# EAGLE design Display_Board (EAGLE 8.4.1)

## Sheet 1 of 3: Micro and CAN
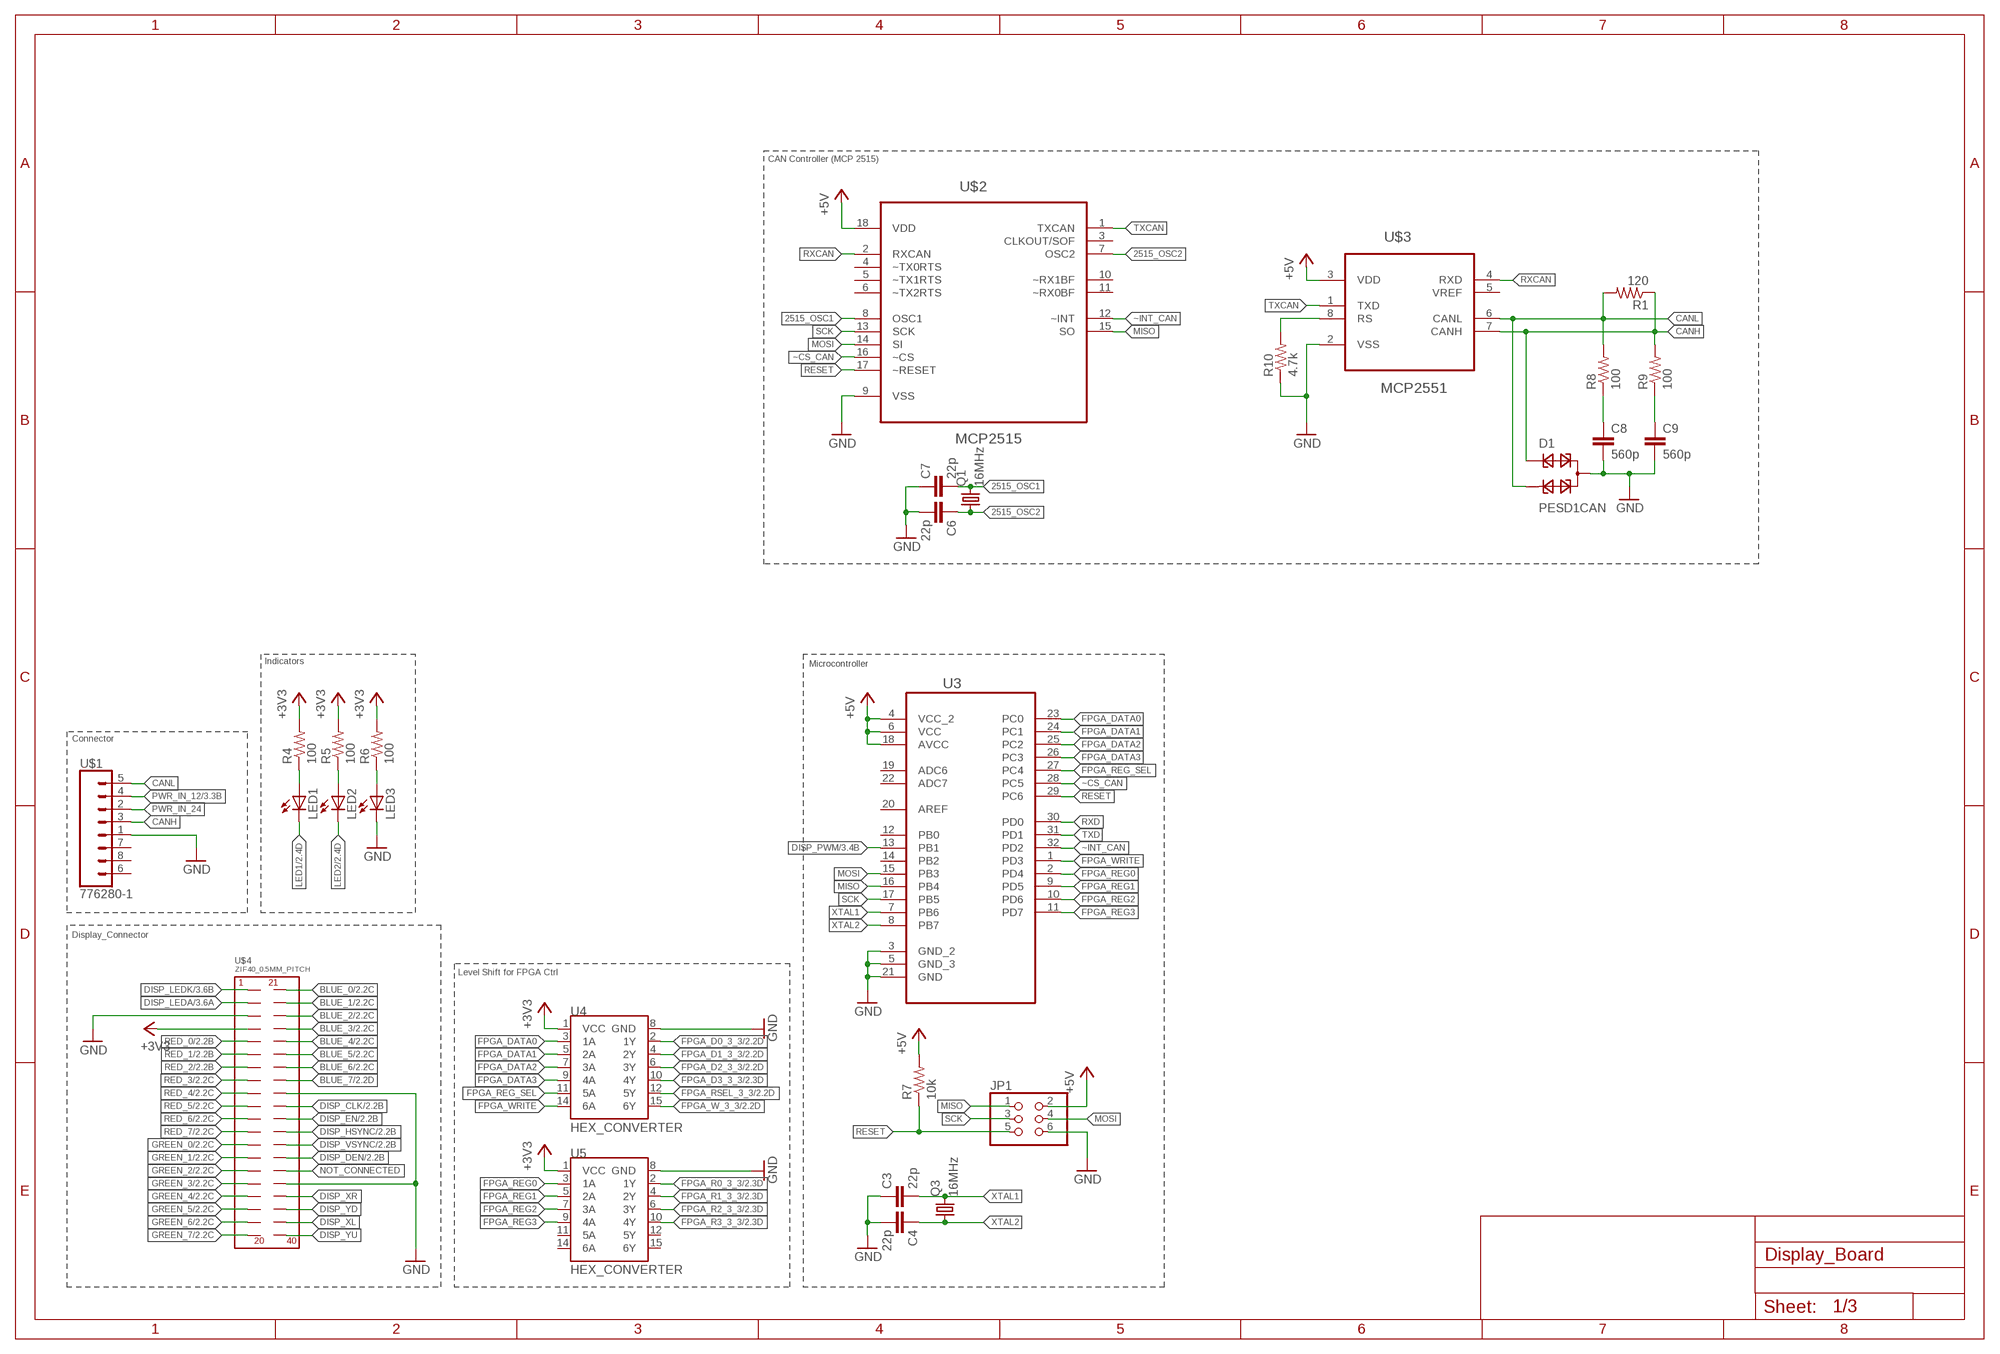
[diagram p0: schematic, sheet 1]

### Parts
C3  22p  C-EUC0805K  [C0805K]
C4  22p  C-EUC0805K  [C0805K]
C6  22p  C-EUC0805K  [C0805K]
C7  22p  C-EUC0805K  [C0805K]
C8  560p  C-EUC0805K  [C0805K]
C9  560p  C-EUC0805K  [C0805K]
D1  PESD1CAN  [SOT23]
JP1  PINHD-2X3  [2X03]
LED1  LEDCHIP-LED0805  [CHIP-LED0805]
LED2  LEDCHIP-LED0805  [CHIP-LED0805]
LED3  LEDCHIP-LED0805  [CHIP-LED0805]
Q1  16MHz  CRYSTALCTS406  [CTS406]
Q3  16MHz  CRYSTALCTS406  [CTS406]
R1  120  R-US_R0805  [R0805]
R4  100  R-US_R0805  [R0805]
R5  100  R-US_R0805  [R0805]
R6  100  R-US_R0805  [R0805]
R7  10k  R-US_R0805  [R0805]
R8  100  R-US_R0805  [R0805]
R9  100  R-US_R0805  [R0805]
R10  4.7k  R-US_R0805  [R0805]
U3  ATMEGA328P-AU  [QFP80P900X900X120-32N]
U4  HEX_CONVERTER  [SO016]
U5  HEX_CONVERTER  [SO016]
U$1  776280-1  [776280-1]
U$2  MCP2515  MCP2515-I/SO  [SOIC127P1034X264-18N]
U$3  MCP2551  MCP2551-I/SN  [SOIC127P600X175-8N]
U$4  ZIF40_0.5MM_PITCH  [ZIF40]

### Nets
2515_OSC1: C7.2 Q1.3 U$2.8(OSC1)
2515_OSC2: C6.1 Q1.1 U$2.7(OSC2)
+3V3: R4.2 R5.2 R6.2 U4.1(VCC) U5.1(VCC) U$4.P$4 ; also sheet 2,3
+5V: JP1.2 R7.2 U3.4(VCC_2) U3.6(VCC) U3.18(AVCC) U$2.18(VDD) U$3.3(VDD) ; also sheet 3
BLUE_0: U$4.P$21 ; also sheet 2
BLUE_1: U$4.P$22 ; also sheet 2
BLUE_2: U$4.P$23 ; also sheet 2
BLUE_3: U$4.P$24 ; also sheet 2
BLUE_4: U$4.P$25 ; also sheet 2
BLUE_5: U$4.P$26 ; also sheet 2
BLUE_6: U$4.P$27 ; also sheet 2
BLUE_7: U$4.P$28 ; also sheet 2
CANH: D1.1 R1.1 R9.2 U$1.3 U$3.7(CANH)
CANL: D1.2 R1.2 R8.2 U$1.5 U$3.6(CANL)
DISP_CLK: U$4.P$30 ; also sheet 2
DISP_DEN: U$4.P$34 ; also sheet 2
DISP_EN: U$4.P$31 ; also sheet 2
DISP_HSYNC: U$4.P$32 ; also sheet 2
DISP_LEDA: U$4.P$2 ; also sheet 3
DISP_LEDK: U$4.P$1 ; also sheet 3
DISP_PWM: U3.13(PB1) ; also sheet 3
DISP_VSYNC: U$4.P$33 ; also sheet 2
DISP_XL: U$4.P$39
DISP_XR: U$4.P$37
DISP_YD: U$4.P$38
DISP_YU: U$4.P$40
FPGA_D0_3_3: U4.2(1Y) ; also sheet 2
FPGA_D1_3_3: U4.4(2Y) ; also sheet 2
FPGA_D2_3_3: U4.6(3Y) ; also sheet 2
FPGA_D3_3_3: U4.10(4Y) ; also sheet 2
FPGA_DATA0: U3.23(PC0) U4.3(1A)
FPGA_DATA1: U3.24(PC1) U4.5(2A)
FPGA_DATA2: U3.25(PC2) U4.7(3A)
FPGA_DATA3: U3.26(PC3) U4.9(4A)
FPGA_R0_3_3: U5.2(1Y) ; also sheet 2
FPGA_R1_3_3: U5.4(2Y) ; also sheet 2
FPGA_R2_3_3: U5.6(3Y) ; also sheet 2
FPGA_R3_3_3: U5.10(4Y) ; also sheet 2
FPGA_REG0: U3.2(PD4) U5.3(1A)
FPGA_REG1: U3.9(PD5) U5.5(2A)
FPGA_REG2: U3.10(PD6) U5.7(3A)
FPGA_REG3: U3.11(PD7) U5.9(4A)
FPGA_REG_SEL: U3.27(PC4) U4.11(5A)
FPGA_RSEL_3_3: U4.12(5Y) ; also sheet 2
FPGA_W_3_3: U4.15(6Y) ; also sheet 2
FPGA_WRITE: U3.1(PD3) U4.14(6A)
GND: C3.1 C4.2 C6.2 C7.1 C8.2 C9.2 D1.3 JP1.6 LED3.C R10.1 U3.3(GND_2) U3.5(GND_3) U3.21(GND) U4.8(GND) U5.8(GND) U$1.1 U$2.9(VSS) U$3.2(VSS) U$4.P$3 U$4.P$29 U$4.P$36 ; also sheet 2,3
GREEN_0: U$4.P$13 ; also sheet 2
GREEN_1: U$4.P$14 ; also sheet 2
GREEN_2: U$4.P$15 ; also sheet 2
GREEN_3: U$4.P$16 ; also sheet 2
GREEN_4: U$4.P$17 ; also sheet 2
GREEN_5: U$4.P$18 ; also sheet 2
GREEN_6: U$4.P$19 ; also sheet 2
GREEN_7: U$4.P$20 ; also sheet 2
LED1: LED1.C ; also sheet 2
LED2: LED2.C ; also sheet 2
MISO: JP1.1 U3.16(PB4) U$2.15(SO)
MOSI: JP1.4 U3.15(PB3) U$2.14(SI)
N$2: LED1.A R4.1
N$3: LED2.A R5.1
N$4: LED3.A R6.1
N$5: R10.2 U$3.8(RS)
N$6: C8.1 R8.1
N$7: C9.1 R9.1
NOT_CONNECTED: U$4.P$35
PWR_IN_12: U$1.4 ; also sheet 3
PWR_IN_24: U$1.2
RED_0: U$4.P$5 ; also sheet 2
RED_1: U$4.P$6 ; also sheet 2
RED_2: U$4.P$7 ; also sheet 2
RED_3: U$4.P$8 ; also sheet 2
RED_4: U$4.P$9 ; also sheet 2
RED_5: U$4.P$10 ; also sheet 2
RED_6: U$4.P$11 ; also sheet 2
RED_7: U$4.P$12 ; also sheet 2
RESET: JP1.5 R7.1 U3.29(PC6) U$2.17(~RESET)
RXCAN: U$2.2(RXCAN) U$3.4(RXD)
RXD: U3.30(PD0)
SCK: JP1.3 U3.17(PB5) U$2.13(SCK)
TXCAN: U$2.1(TXCAN) U$3.1(TXD)
TXD: U3.31(PD1)
XTAL1: C3.2 Q3.3 U3.7(PB6)
XTAL2: C4.1 Q3.1 U3.8(PB7)
~CS_CAN: U3.28(PC5) U$2.16(~CS)
~INT_CAN: U3.32(PD2) U$2.12(~INT)
Unconnected: U3.12(PB0) U3.14(PB2) U3.19(ADC6) U3.20(AREF) U3.22(ADC7) U5.11(5A) U5.12(5Y) U5.14(6A) U5.15(6Y) U$1.6 U$1.7 U$1.8 U$2.3(CLKOUT/SOF) U$2.4(~TX0RTS) U$2.5(~TX1RTS) U$2.6(~TX2RTS) U$2.10(~RX1BF) U$2.11(~RX0BF) U$3.5(VREF)

### Notes on the sheet
- CAN Controller (MCP 2515)
- Indicators | Microcontroller
- Connector
- Display_Connector
- Level Shift for FPGA Ctrl

## Sheet 2 of 3: FPGA
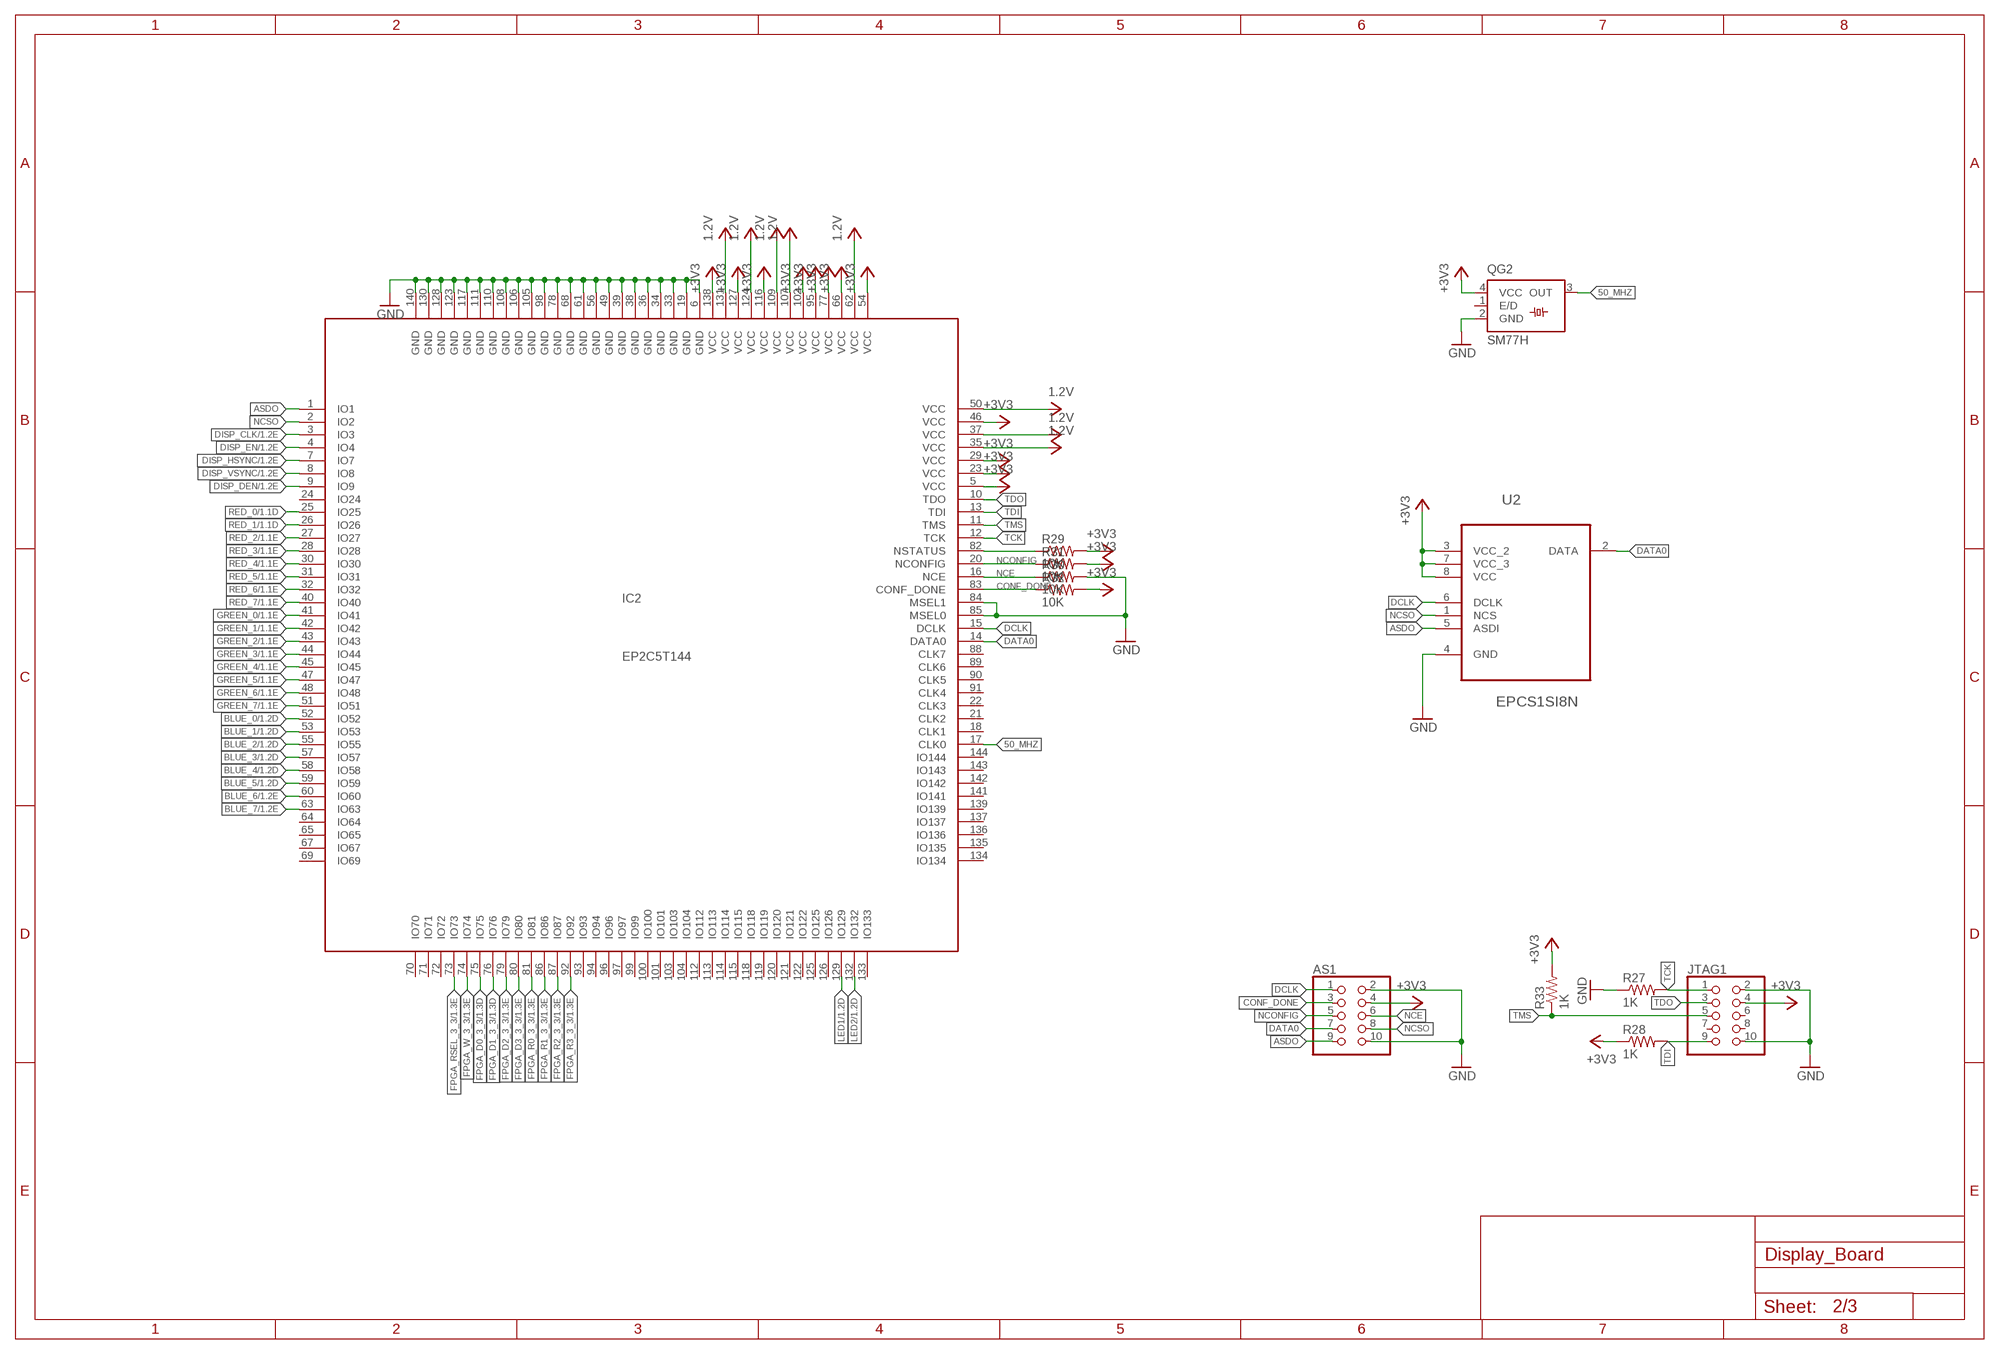
[diagram p1: schematic, sheet 2]

### Parts
AS1  PINHD-2X5  [2X05]
IC2  EP2C5T144  [TQFP144]
JTAG1  PINHD-2X5  [2X05]
QG2  SM77H  [SM77H]
R27  1K  R-US_R0805  [R0805]
R28  1K  R-US_R0805  [R0805]
R29  10K  R-US_R0805  [R0805]
R30  10K  R-US_R0805  [R0805]
R31  10K  R-US_R0805  [R0805]
R32  10K  R-US_R0805  [R0805]
R33  1K  R-US_R0805  [R0805]
U2  EPCS1SI8N  [SOIC127P600X175-8N]

### Nets
50_MHZ: IC2.17(CLK0) QG2.3(OUT)
+3V3: AS1.4 IC2.5(VCC) IC2.23(VCC) IC2.29(VCC) IC2.46(VCC) IC2.54(VCC) IC2.66(VCC) IC2.77(VCC) IC2.95(VCC) IC2.102(VCC) IC2.116(VCC) IC2.127(VCC) IC2.138(VCC) JTAG1.4 QG2.4(VCC) R28.1 R29.2 R31.2 R32.2 R33.2 U2.3(VCC_2) U2.7(VCC_3) U2.8(VCC) ; also sheet 1,3
ASDO: AS1.9 IC2.1(IO1) U2.5(ASDI)
BLUE_0: IC2.52(IO52) ; also sheet 1
BLUE_1: IC2.53(IO53) ; also sheet 1
BLUE_2: IC2.55(IO55) ; also sheet 1
BLUE_3: IC2.57(IO57) ; also sheet 1
BLUE_4: IC2.58(IO58) ; also sheet 1
BLUE_5: IC2.59(IO59) ; also sheet 1
BLUE_6: IC2.60(IO60) ; also sheet 1
BLUE_7: IC2.63(IO63) ; also sheet 1
CONF_DONE: AS1.3 IC2.83(CONF_DONE) R32.1
DATA0: AS1.7 IC2.14(DATA0) U2.2(DATA)
DCLK: AS1.1 IC2.15(DCLK) U2.6(DCLK)
DISP_CLK: IC2.3(IO3) ; also sheet 1
DISP_DEN: IC2.9(IO9) ; also sheet 1
DISP_EN: IC2.4(IO4) ; also sheet 1
DISP_HSYNC: IC2.7(IO7) ; also sheet 1
DISP_VSYNC: IC2.8(IO8) ; also sheet 1
FPGA_D0_3_3: IC2.75(IO75) ; also sheet 1
FPGA_D1_3_3: IC2.76(IO76) ; also sheet 1
FPGA_D2_3_3: IC2.79(IO79) ; also sheet 1
FPGA_D3_3_3: IC2.80(IO80) ; also sheet 1
FPGA_R0_3_3: IC2.81(IO81) ; also sheet 1
FPGA_R1_3_3: IC2.86(IO86) ; also sheet 1
FPGA_R2_3_3: IC2.87(IO87) ; also sheet 1
FPGA_R3_3_3: IC2.92(IO92) ; also sheet 1
FPGA_RSEL_3_3: IC2.73(IO73) ; also sheet 1
FPGA_W_3_3: IC2.74(IO74) ; also sheet 1
GND: AS1.2 AS1.10 IC2.6(GND) IC2.19(GND) IC2.33(GND) IC2.34(GND) IC2.36(GND) IC2.38(GND) IC2.39(GND) IC2.49(GND) IC2.56(GND) IC2.61(GND) IC2.68(GND) IC2.78(GND) IC2.84(MSEL1) IC2.85(MSEL0) IC2.98(GND) IC2.105(GND) IC2.106(GND) IC2.108(GND) IC2.110(GND) IC2.111(GND) IC2.117(GND) IC2.123(GND) IC2.128(GND) IC2.130(GND) IC2.140(GND) JTAG1.2 JTAG1.10 QG2.2(GND) R27.1 R30.2 U2.4(GND) ; also sheet 1,3
GREEN_0: IC2.41(IO41) ; also sheet 1
GREEN_1: IC2.42(IO42) ; also sheet 1
GREEN_2: IC2.43(IO43) ; also sheet 1
GREEN_3: IC2.44(IO44) ; also sheet 1
GREEN_4: IC2.45(IO45) ; also sheet 1
GREEN_5: IC2.47(IO47) ; also sheet 1
GREEN_6: IC2.48(IO48) ; also sheet 1
GREEN_7: IC2.51(IO51) ; also sheet 1
LED1: IC2.129(IO129) ; also sheet 1
LED2: IC2.132(IO132) ; also sheet 1
N$21: IC2.82(NSTATUS) R29.1
NCE: AS1.6 IC2.16(NCE) R30.1
NCONFIG: AS1.5 IC2.20(NCONFIG) R31.1
NCSO: AS1.8 IC2.2(IO2) U2.1(NCS)
RED_0: IC2.25(IO25) ; also sheet 1
RED_1: IC2.26(IO26) ; also sheet 1
RED_2: IC2.27(IO27) ; also sheet 1
RED_3: IC2.28(IO28) ; also sheet 1
RED_4: IC2.30(IO30) ; also sheet 1
RED_5: IC2.31(IO31) ; also sheet 1
RED_6: IC2.32(IO32) ; also sheet 1
RED_7: IC2.40(IO40) ; also sheet 1
TCK: IC2.12(TCK) JTAG1.1 R27.2
TDI: IC2.13(TDI) JTAG1.9 R28.2
TDO: IC2.10(TDO) JTAG1.3
TMS: IC2.11(TMS) JTAG1.5 R33.1
VCC: IC2.35(VCC) IC2.37(VCC) IC2.50(VCC) IC2.62(VCC) IC2.107(VCC) IC2.109(VCC) IC2.124(VCC) IC2.131(VCC) ; supply symbol labelled 1.2V ; also sheet 3
Unconnected: IC2.18(CLK1) IC2.21(CLK2) IC2.22(CLK3) IC2.24(IO24) IC2.64(IO64) IC2.65(IO65) IC2.67(IO67) IC2.69(IO69) IC2.70(IO70) IC2.71(IO71) IC2.72(IO72) IC2.88(CLK7) IC2.89(CLK6) IC2.90(CLK5) IC2.91(CLK4) IC2.93(IO93) IC2.94(IO94) IC2.96(IO96) IC2.97(IO97) IC2.99(IO99) IC2.100(IO100) IC2.101(IO101) IC2.103(IO103) IC2.104(IO104) IC2.112(IO112) IC2.113(IO113) IC2.114(IO114) IC2.115(IO115) IC2.118(IO118) IC2.119(IO119) IC2.120(IO120) IC2.121(IO121) IC2.122(IO122) IC2.125(IO125) IC2.126(IO126) IC2.133(IO133) IC2.134(IO134) IC2.135(IO135) IC2.136(IO136) IC2.137(IO137) IC2.139(IO139) IC2.141(IO141) IC2.142(IO142) IC2.143(IO143) IC2.144(IO144) JTAG1.6 JTAG1.7 JTAG1.8 QG2.1(E/D)

## Sheet 3 of 3: Power
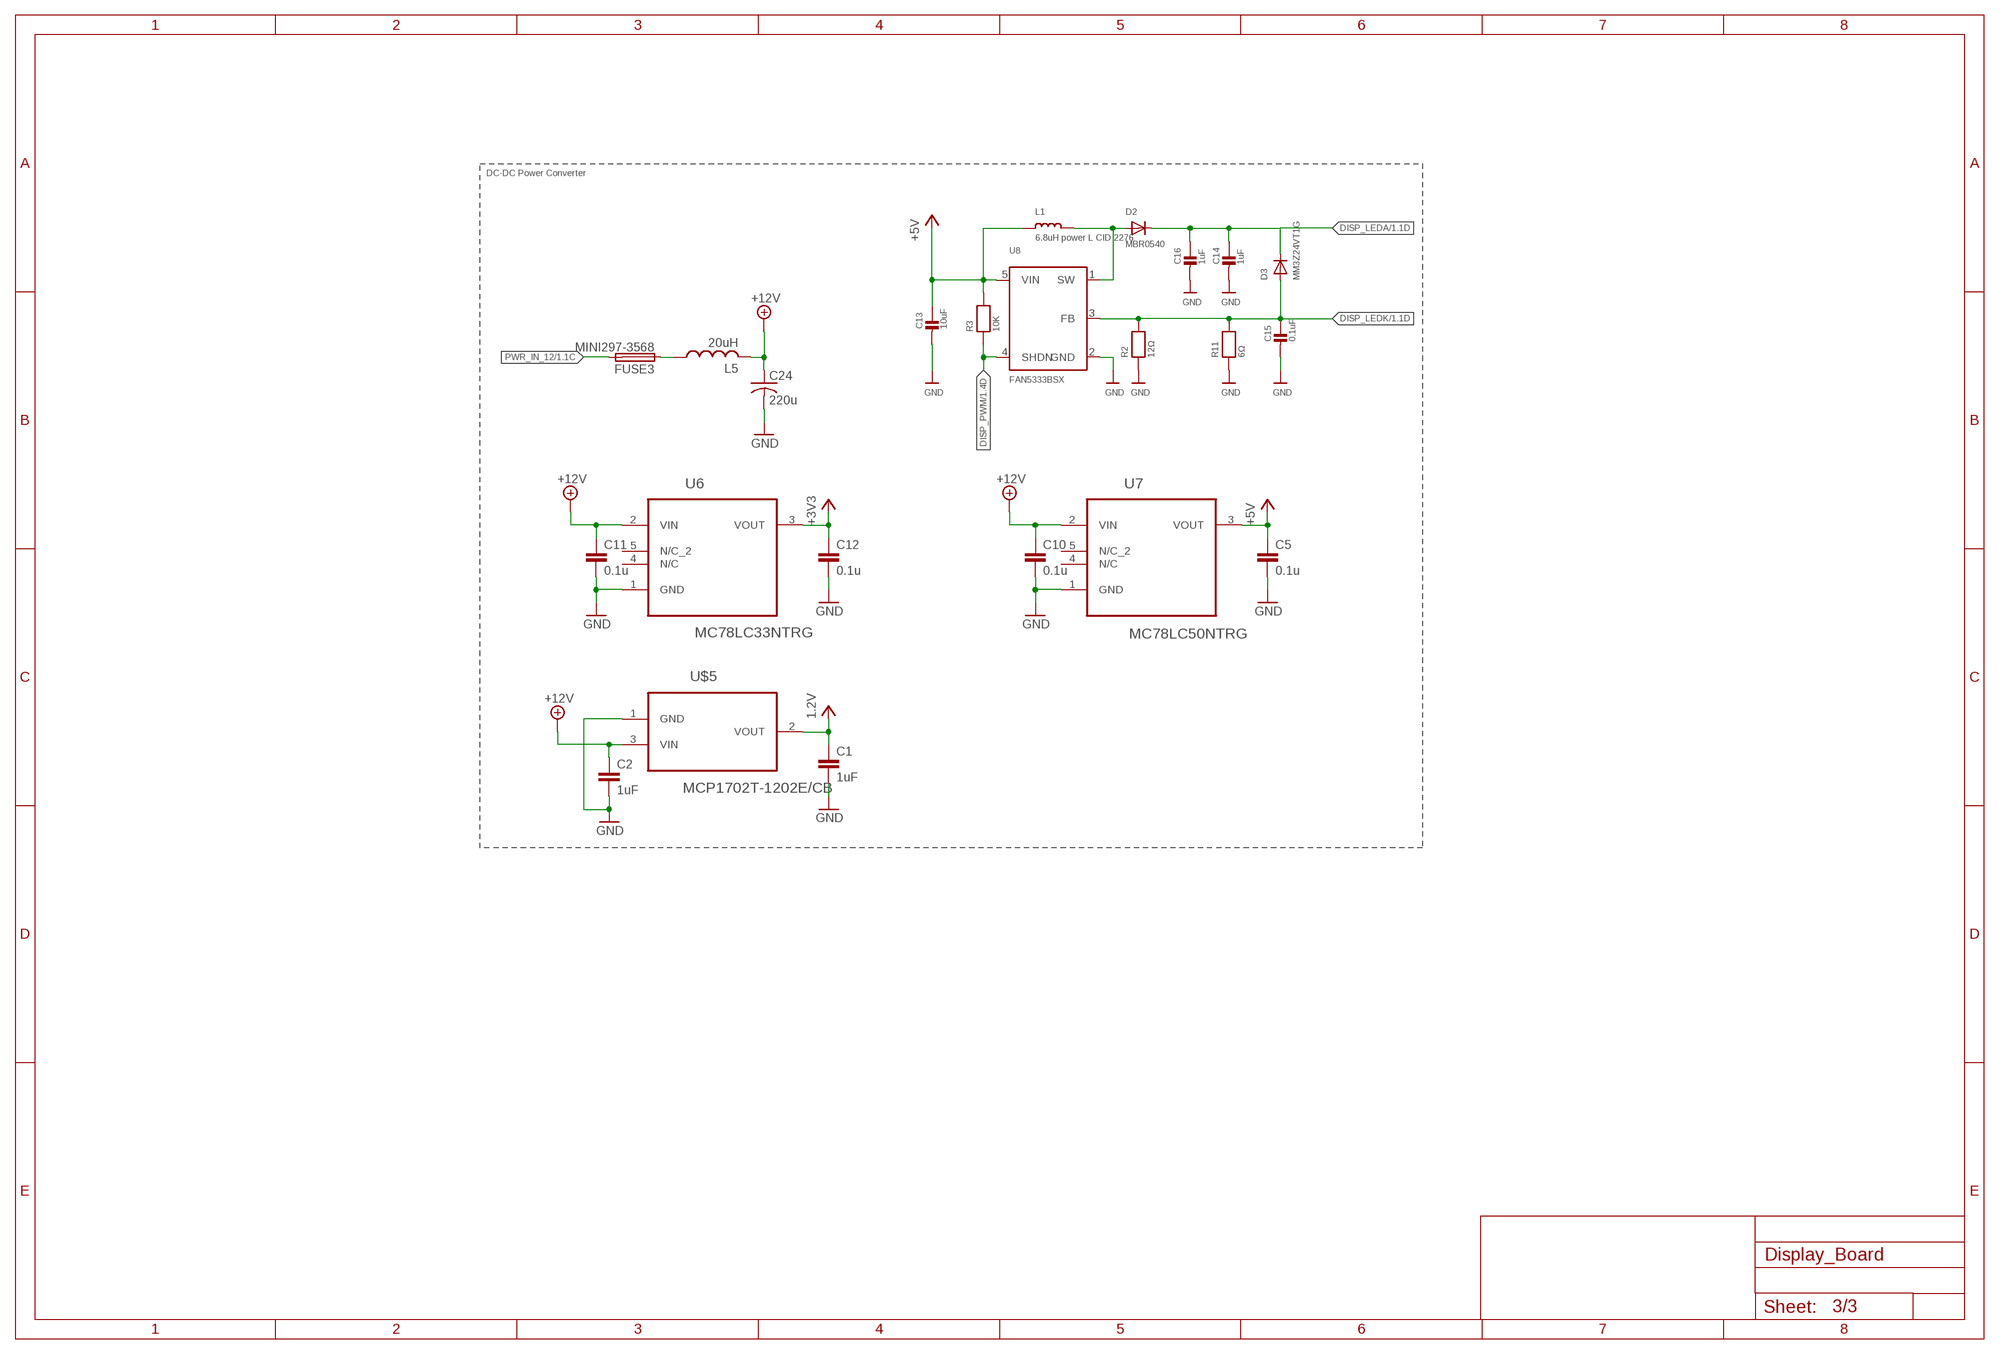
[diagram p2: schematic, sheet 3]

### Parts
C1  1uF  C-EUC0805K  [C0805K]
C2  1uF  C-EUC0805K  [C0805K]
C5  0.1u  C-EUC0805K  [C0805K]
C10  0.1u  C-EUC0805K  [C0805K]
C11  0.1u  C-EUC0805K  [C0805K]
C12  0.1u  C-EUC0805K  [C0805K]
C13  10uF  CAP_CERAMIC_0805MP  [_0805MP]
C14  1uF  CAP_CERAMIC_0805MP  [_0805MP]
C15  0.1uF  CAP_CERAMIC_0805MP  [_0805MP]
C16  1uF  CAP_CERAMIC_0805MP  [_0805MP]
C24  220u  C1206  [C1206]
D2  MBR0540  DIODESOD-123  [SOD-123]
D3  MM3Z24VT1G  DIODESMA  [SMADIODE]
FUSE3  MINI297-3568  [3568]
L1  6.8uH power L CID 2276  INDUCTORNR5040  [INDUCTOR_5X5MM_NR5040_NOTHERMALS]
L5  20uH  MSS7348  [MSS7348]
R2  12Ω  RESISTOR_0805MP  [_0805MP]
R3  10K  RESISTOR_0805MP  [_0805MP]
R11  6Ω  RESISTOR_0805MP  [_0805MP]
U6  MC78LC33NTRG  [SOT95P275X110-5N]
U7  MC78LC50NTRG  [SOT95P275X110-5N]
U8  FAN5333BSX  FAN5331  [SOT23-5@1]
U$5  MCP1702T-1202E/CB  MCP1702T-1802E/CB  [SOT95P300X145-3N]

### Nets
+3V3: C12.1 U6.3(VOUT) ; also sheet 1,2
+5V: C5.1 C13.1 L1.P$1 R3.2 U7.3(VOUT) U8.5(VIN) ; also sheet 1
+12V: C2.1 C10.1 C11.1 C24.1 L5.P$2 U6.2(VIN) U7.2(VIN) U$5.3(VIN)
DISP_LEDA: C14.1 C16.1 D2.C D3.C ; also sheet 1
DISP_LEDK: C15.1 D3.A R2.2 R11.2 U8.3(FB) ; also sheet 1
DISP_PWM: R3.1 U8.4(SHDN) ; also sheet 1
GND: C1.2 C2.2 C5.2 C10.2 C11.2 C12.2 C13.2 C14.2 C15.2 C16.2 C24.2 R2.1 R11.1 U6.1(GND) U7.1(GND) U8.2(GND) U$5.1(GND) ; also sheet 1,2
N$1: FUSE3.P$1 FUSE3.P$4 L5.P$1
N$8: D2.A L1.P$2 U8.1(SW)
PWR_IN_12: FUSE3.P$2 FUSE3.P$3 ; also sheet 1
VCC: C1.1 U$5.2(VOUT) ; supply symbol labelled 1.2V ; also sheet 2
Unconnected: U6.4(N/C) U6.5(N/C_2) U7.4(N/C) U7.5(N/C_2)

### Notes on the sheet
- DC-DC Power Converter

## Library data of the parts
AS1 JTAG1 = pinhead:PINHD-2X5: PIN HEADER
C1 C2 C5 C8-C12 = rcl:C-EU: CAPACITOR, European symbol
C3 C4 C6 C7 = resistor:C-EU: CAPACITOR, European symbol
C13-C16 = microbuilder:CAP_CERAMIC: Ceramic Capacitors For new designs, use the packages preceded by an '_' character since they are more reliable: The following footprints should be used on most boards: _0402 - Standard footprint for regular board layouts _0603 - Standard footprint for regular board layouts _0805 - Standard footprint for regular board layouts For extremely tight-pitch boards where space is at a premium, the following 'micro-pitch' footprints can be used (smaller pads, no silkscreen outline, etc.): _0402MP - Micro-pitch footprint for very dense/compact boards _0603MP - Micro-pitch footprint for very dense/compact boards _0805MP - Micro-pitch footprint for very dense/compact boards Commonly Stocked Parts 0402 - 0402 Surface Mount Capacitors 16pF 50V 5% [Digikey: 445-4899-2-ND] 18pF 50V 5% [Digikey: 490-1281-2-ND] 22pF 50V 5% [Digikey: 490-1283-2-ND] 68pF 50V 5% [Digikey: 490-1289-2-ND] 0.1uF 10V 10% [Digikey: 490-1318-2-ND] 1.0uF 6.3V 10% [Digikey: 490-1320-2-ND] 0603 - 0603 Surface Mount Capacitors 16 pF 50V 5% [Digikey: 445-5051-2-ND] 22 pF 50V [Digikey: PCC220ACVTR-ND] 33 pF 50V 5% [Digikey: 490-1415-1-ND] 56pF 50V 5% [Digikey: 490-1421-1-ND] 220pF 50V 5% [Digikey: 445-1285-1-ND] 680 pF 50V 2200 pF 50V 5% C0G [Digikey: 445-1297-1-ND] 5600 pF 100V 5% X7R [Digikey: 478-3711-1-ND] 0.1 µF 25V 10% [Digikey: PCC2277TR-ND] 0.22 µF 16V 10% X7R [Digikey: 445-1318-1-ND] 1.0 µF 25V 10% [Digikey: 445-5146-2-ND] 0603 - RF Specific 3pF 250V +/-0.1pF RF [Digikey: 712-1347-1-ND] 18 pF 250V 5% [Digikey: 478-3505-1-ND or 712-1322-1-ND] 56 pF 250V 5% C0G RF [Digikey: 490-4867-1-ND] 68 pF 250V RF [Digikey: 490-4868-1-ND] 0805 - 0805 Surface Mount Capacitors 220 pF 250V 2% RF Ceramic Capacitor [Digikey: 712-1398-1-ND] 1000 pF 50V 2% NP0 Ceramic Capacitor [Digikey: 478-3760-1-ND] 0.1 µF 25V 10% Ceramic Capacitor [Digikey: PCC1828TR-ND] 1.0 µF 16V 10% Ceramic Capacitor[Digikey: 490-1691-2-ND] 10.0 µF 10V 10% Ceramic Capacitor[Digikey: 709-1228-1-ND] 10.0 uF 16V 10% Ceramic Capacitor [Digikey: 478-5165-2-ND] 47 uF 6.3V 20% Ceramic Capacitor [Digikey: 587-1779-1-ND or 399-5506-1-ND] 1206 - 1206 Surface Mount Capacitors 47uF 10V 20% Ceramic Capacitor [Digikey: 490-5528-1-ND or 399-5508-1-ND or 445-6010-1-ND] 100uF 6.3V -20%, +80% Y5V Ceramic Capacitor (Digikey: 490-4512-1-ND, Mouser: 81-GRM31CF50J107ZE1L)
C24 = Capacitors:C1206
D1 = diode:PESD1CAN: CAN bus ESD protection diode Source: http://www.nxp.com/documents/data_sheet/PESD1CAN.pdf
D2 D3 = microbuilder:DIODE: Diode SMA Model Volts Amps Type Vf Vr Digikey # Notes SSA34-E3 40V 3A Schottky 480mV @ 3A 200uA @ 40V SSA34-E3/61TGITR-ND CDBA120-G 20V 1A Schottky 500mV @ 1A 500uA @ 20V 641-1014-6-ND REEL MBRA210 10V 2A Schottky 350mV @ 2A 700uA @ 10V MBRA210LT3 SOD-123 Model Volts Amps Type Vf Vr Order # Notes BAT54T1G 30V 200mA Schottky 800mV @ 200mA 2uA @ 25V BAT54T1GOSTR-ND B0530W 30V 500mA Schottky 430mV @ 500mA 130uA @ 30V B0530W-FDICT-ND REEL MBR120 20V 1A Schottky 340mV @ 1A MBR120VLSFT1GOSCT-ND SOD-323 Model Volts Amps Type Vf Vr Order # Notes PMEG2005EJ 20V 500mA Schottky 355mV @ 500mA 568-4110-1-ND ZLLS410 10V 570mA Schottky 380mV @ 570mA ZLLS410CT-ND 1N4148WS 75V 150mA Silicon/Simple 1V 1N4148WSFSCT-ND REEL SOD-523 Model Volts Amps Type Vf Vr Order # Notes BAT54XV2 30V 200mA Schottky 0.8V @ 100mA BAT54XV2CT-ND TB751S 30V 30mA Schottky RB751S-40TE61CT-ND SOT23-R/W (R = Solder Paste/Reflow Ovens, W = Hand-Soldering) Model Volts Amps Type Vf Vr Order # Notes BAT54FILM 40V 300mA Schottky 497-7162-1-ND
FUSE3 = Fuse:MINI297-3568
IC2 = altera-cyclone-II:EP2C5T144: EP2C5T144 Auto generated by make-symbol-device-package-bsdl.ulp Rev. 19 Tip: Use split-device-symbol.ulp to generate a Device with multiple small symbols! Read HELP. Source: EP2C5T144.BSD; MPN: EP2C5T144C8N; OC_FARNELL: 1453495; OC_NEWARK: 51R0568
JP1 = pinhead:PINHD-2X3: PIN HEADER
L1 = microbuilder:INDUCTOR: Inductors 0603: 10nH Ceramic Inductor - microwire antenna/RF (Digikey: 712-1434-2-ND) 0805: 560nH Ceramic Inductor - RF (Digikey: 553-1047-1-ND) 270nH Ceramic Inductor - Q = 40@250MHz, +-5%, 1 Ohm DC Resistance (Digikey: 535-10506-2-ND) 1007 (2518 Metric) SMT: 10µH 10% 250mOhm 820mA 1007 Inductor (Digikey: 587-2189-1-ND) 22µH 10% 500mOhm 580mA 1007 Inductor (Digikey: 587-2190-1-ND) 47µH 10% 950mOhm 420mA 1007 Inductor (Digikey: 587-2191-1-ND) 47µH 5% 100mOhm 1A 1008 Inductor (Digikey: 732-1816-1-ND) 5.0x5.0mm (Taiyo Yuden NR5040 Series) 6.8µH 20% 2.3A 64mOhm Inductor (Digikey: 587-2374-2-ND) 5.0x5.0mm (TDK VLC5045 Series) 4.7µH 20% 3.3A 34mOhm Inductor (Digikey: 445-6526-1-ND) 6.8µH 20% 2.7A 46mOhm Inductor (Digikey: 445-6527-1-ND) 6.0x6.0mm (TDK VLC6045 Series) 4.7µH 20% 3.8A 27mOhm Inductor (Digikey: 445-6538-2-ND) 6.8µH 20% 3A 41mOhm Inductor (Digikey: 445-6540-1-ND) 6.2µH 30% 2.2A 45mOhm Inductor (Digikey: SRR5028-6R2YCT-ND) - Not TDK VLC6045 but footprint should match 6.0x6.0mm (TDK SLF6045 Series) 6.8uH 30% 2A 33mOhm Inductor (Digikey: 445-4572-1-ND, Mouser: 810-SLF645T6R8N2R0PF) 6.0x6.0mm (Sumida CDRH5D28 Series) 6.2uH 30% 1.8A 45mOhm Inductor (Digikey: 308-1542-1-ND) Taiyo Yuden NR3015T2R2M - 2.2uH 20% 1.5A (Digikey: 587-1648-2-ND, Mouser: 963-NR3015T2R2M) - Used with TI TPS62172 CoilCraft RFID Transponder Coil - MA5532-AE (For use with AS3935 Lightning Sensor)
L5 = Inductors:MSS7348
LED1-LED3 = led:LED: LED OSRAM: - CHIPLED LG R971, LG N971, LY N971, LG Q971, LY Q971, LO R971, LY R971 LH N974, LH R974 LS Q976, LO Q976, LY Q976 LO Q996 - Hyper CHIPLED LW Q18S LB Q993, LB Q99A, LB R99A - SideLED LS A670, LO A670, LY A670, LG A670, LP A670 LB A673, LV A673, LT A673, LW A673 LH A674 LY A675 LS A676, LA A676, LO A676, LY A676, LW A676 LS A679, LY A679, LG A679 - Hyper Micro SIDELED® LS Y876, LA Y876, LO Y876, LY Y876 LT Y87S - SmartLED LW L88C, LW L88S LB L89C, LB L89S, LG L890 LS L89K, LO L89K, LY L89K LS L896, LA L896, LO L896, LY L896 - TOPLED LS T670, LO T670, LY T670, LG T670, LP T670 LSG T670, LSP T670, LSY T670, LOP T670, LYG T670 LG T671, LOG T671, LSG T671 LB T673, LV T673, LT T673, LW T673 LH T674 LS T676, LA T676, LO T676, LY T676, LB T676, LH T676, LSB T676, LW T676 LB T67C, LV T67C, LT T67C, LS T67K, LO T67K, LY T67K, LW E67C LS E67B, LA E67B, LO E67B, LY E67B, LB E67C, LV E67C, LT E67C LW T67C LS T679, LY T679, LG T679 LS T770, LO T770, LY T770, LG T770, LP T770 LB T773, LV T773, LT T773, LW T773 LH T774 LS E675, LA E675, LY E675, LS T675 LS T776, LA T776, LO T776, LY T776, LB T776 LHGB T686 LT T68C, LB T68C - Hyper Mini TOPLED® LB M676 - Mini TOPLED Santana® LG M470 LS M47K, LO M47K, LY M47K Source: http://www.osram.convergy.de LUXEON: - LUMILED® LXK2-PW12-R00, LXK2-PW12-S00, LXK2-PW14-U00, LXK2-PW14-V00 LXK2-PM12-R00, LXK2-PM12-S00, LXK2-PM14-U00 LXK2-PE12-Q00, LXK2-PE12-R00, LXK2-PE12-S00, LXK2-PE14-T00, LXK2-PE14-U00 LXK2-PB12-K00, LXK2-PB12-L00, LXK2-PB12-M00, LXK2-PB14-N00, LXK2-PB14-P00, LXK2-PB14-Q00 LXK2-PR12-L00, LXK2-PR12-M00, LXK2-PR14-Q00, LXK2-PR14-R00 LXK2-PD12-Q00, LXK2-PD12-R00, LXK2-PD12-S00 LXK2-PH12-R00, LXK2-PH12-S00 LXK2-PL12-P00, LXK2-PL12-Q00, LXK2-PL12-R00 Source: www.luxeon.com KINGBRIGHT: KA-3528ASYC Source: www.kingbright.com
Q1 Q3 = adafruit:CRYSTAL: CRYSTAL; OC_FARNELL: unknown; OC_NEWARK: unknown
QG2 = crystal:SM77H: 3.3V CMOS Clock Oscillator Source: www.pletronics.com .. sm77h%203.3v.pdf; OC_FARNELL: unknown; OC_NEWARK: unknown
R1 R7-R10 = rcl:R-US_: RESISTOR, American symbol
R2 R3 R11 = microbuilder:RESISTOR: Resistors For new designs, use the packages preceded by an '_' character since they are more reliable: The following footprints should be used on most boards: _0402 - Standard footprint for regular board layouts _0603 - Standard footprint for regular board layouts _0805 - Standard footprint for regular board layouts For extremely tight-pitch boards where space is at a premium, the following 'micro-pitch' footprints can be used (smaller pads, no silkscreen outline, etc.): _0402MP - Micro-pitch footprint for very dense/compact boards _0603MP - Micro-pitch footprint for very dense/compact boards _0805MP - Micro-pitch footprint for very dense/compact boards
R4-R6 R27-R33 = resistor:R-US_: RESISTOR, American symbol
U2 = Altera_By_element14_Batch_1:EPCS1SI8N: Serial Configuration Devices; DESCRIPTION: Serial Configuration Devices; MPN: EPCS1SI8N; OC_FARNELL: 1453504; OC_NEWARK: 51R0466; PACKAGE: SOIC-8; SUPPLIER: ALTERA
U3 = Atmel_By_element14_Batch_1-00:ATMEGA328P-AU: 8-bit Microcontroller with In-System Programmable Flash; MPN: ATMEGA328P-AU; OC_FARNELL: 1715486; OC_NEWARK: 14R4631; PACKAGE: TQFP-32; SUPPLIER: Atmel
U4 U5 = SparkFun-DigitalIC:HEX_CONVERTER: 74HC4050 Hex Buffer Level Shifter SMD SO016; PROD_ID: IC-09604
U6 = ON Semiconductor_By_element14_Batch_1:MC78LC33NTRG: Micropower Voltage Regulator; MPN: MC78LC33NTRG; OC_FARNELL: 1652349; OC_NEWARK: 71J5709; PACKAGE: SOT-23-5; SUPPLIER: ON SEMICONDUCTOR
U7 = ON Semiconductor_By_element14_Batch_1:MC78LC50NTRG: Micropower Voltage Regulator; MPN: MC78LC50NTRG; OC_FARNELL: 1652350; OC_NEWARK: 26K4390; PACKAGE: SOT-23-5; SUPPLIER: ON SEMICONDUCTOR
U8 = microbuilder:FAN5331: FAN5331 - LED/OLED 20V Boost Converter Digikey: FAN5331SXCT-ND
U$1 = IFE_AMPSEAL_Conn:776280-1: AMPSEAL 8pin Connector Ampseal 8-pin connector Model: 776280-1
U$2 = Microchip_By_element14_Batch_1:MCP2515-I/SO: CAN Controller; MPN: MCP2515-I/SO; OC_FARNELL: 1292239; OC_NEWARK: 29H7136; PACKAGE: SOIC-18; SUPPLIER: Microchip
U$3 = Microchip_By_element14_Batch_1:MCP2551-I/SN: High-Speed CAN Transceiver; MPN: MCP2551-I/SN; OC_FARNELL: 9758569; OC_NEWARK: 69K7604; PACKAGE: SOIC-8; SUPPLIER: Microchip
U$4 = Connectors:ZIF40_0.5MM_PITCH: 40 Pin 0.5mm ptch FPC Connector http://www.buydisplay.com/default/40-pin-0-5mm-pitch-top-contact-zif-connector-fpc-connector
U$5 = Microchip_By_element14_Batch_1:MCP1702T-1802E/CB: Low Quiescent Current LDO Regulator; DESCRIPTION: LDO VOLT REG; MPN: MCP1702T-1802E/CB; OC_FARNELL: 1331488; OC_NEWARK: 84R5177; PACKAGE: SOT-3; SUPPLIER: Microchip

## Board
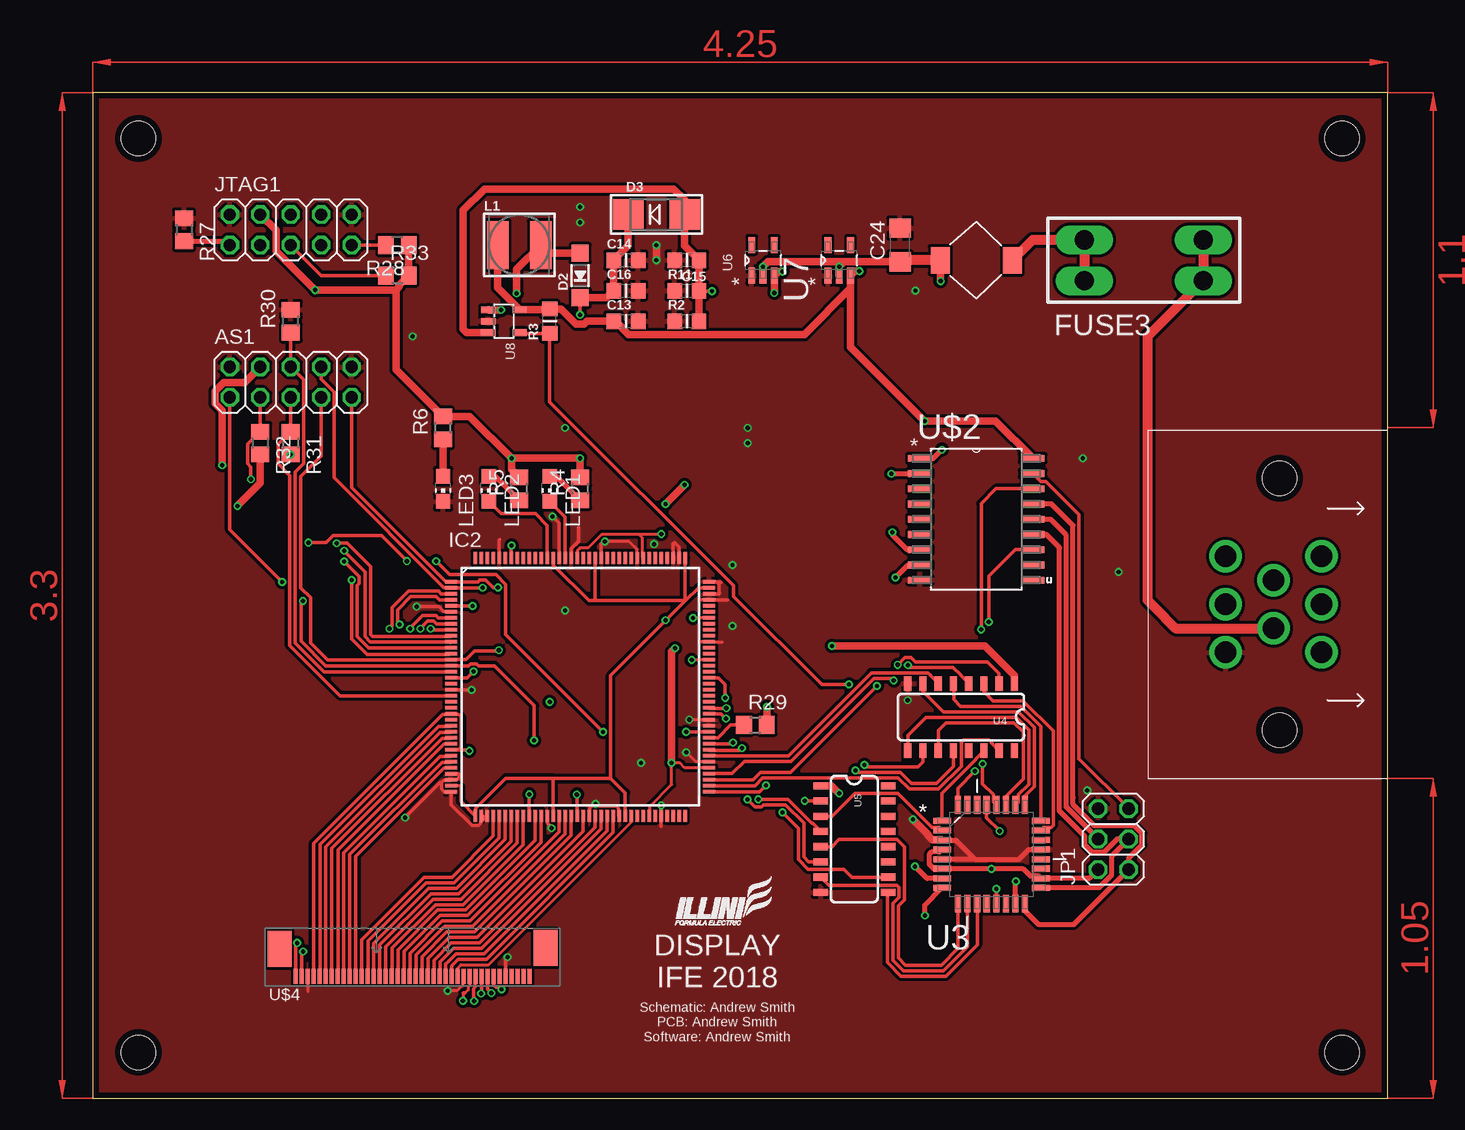
[diagram p3: board, top side]
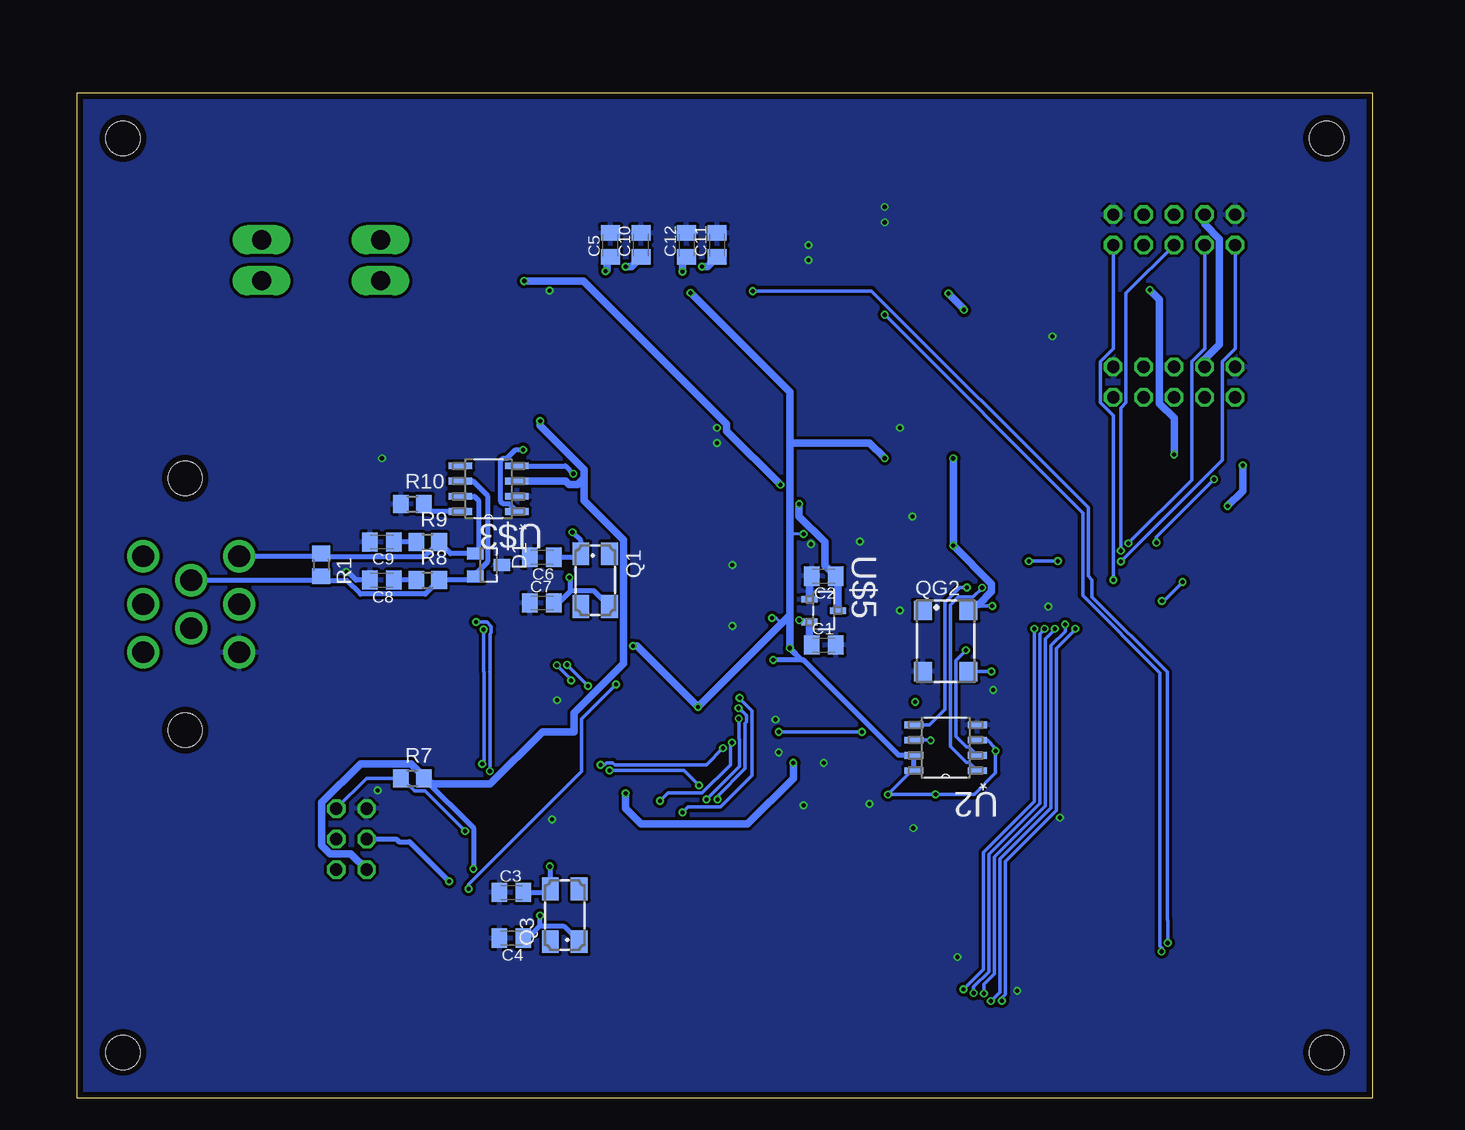
[diagram p4: board, bottom side, seen from below]

Size 107.95 x 83.82 mm. Coordinates in mm from the lower left corner, seen from the top.
Outline: 0,0 107.95,0 107.95,83.82 0,83.82 0,0
Copper layers (1*16): Top 0.035mm / dielectric 1.6mm / Bottom 0.035mm
Design rules "Elecrow_2-layer_PCB_eagle_rule": minimum track width 6mil, minimum drill 12mil, track to track 6mil, track to pad 6mil, pad to pad 6mil, via to via 8mil, smd to smd 0mil, copper to edge 20mil, drill to drill 10mil, minimum pad ring 6mil, minimum via ring 6mil, stop-mask expansion 0mil, vias tented up to drill 100mil, thermal gap 10mil
Holes 2.84 mm at 3.81,80.01 104.14,80.01 104.14,3.81 3.81,3.81

### Footprints (pad centres in the part's own frame; a part is rotated, then mirrored left to right if it is on the bottom)
2X05 = drill 1.016 octagon: 1 -5.08,-1.27; 2 -5.08,1.27; 3 -2.54,-1.27; 4 -2.54,1.27; 5 0,-1.27; 6 0,1.27; 7 2.54,-1.27; 8 2.54,1.27; 9 5.08,-1.27; 10 5.08,1.27
C0805K = smd 1.3 x 1.6: 1 -1,0; 2 1,0
_0805MP = smd 1.2 x 1.3: 1 -1.016,0; 2 1.016,0
C1206 = smd 1.6 x 1.8: 1 -1.4,0; 2 1.4,0
SOT23 = smd 1 x 1.4: 1 -0.95,-1.1; 2 0.95,-1.1; 3 0,1.1
SOD-123 = smd 1.4 x 1.4: A 1.85,0; C -1.85,0
SMADIODE = smd 2.54 x 2.54: A 2.349,0; C -2.349,0
3568 = drill 1.6 long: P$1 -4.96,1.7; P$2 4.96,1.7; P$3 4.96,-1.7; P$4 -4.96,-1.7
TQFP144 = smd 1 x 0.3: 1 -10.75,8.75; 2 -10.75,8.25; 3 -10.75,7.75; 4 -10.75,7.25; 5 -10.75,6.75; 6 -10.75,6.25; 7 -10.75,5.75; 8 -10.75,5.25; 9 -10.75,4.75; 10 -10.75,4.25; 11 -10.75,3.75; 12 -10.75,3.25; 13 -10.75,2.75; 14 -10.75,2.25; 15 -10.75,1.75; 16 -10.75,1.25; 17 -10.75,0.75; 18 -10.75,0.25; 19 -10.75,-0.25; 20 -10.75,-0.75; 21 -10.75,-1.25; 22 -10.75,-1.75; 23 -10.75,-2.25; 24 -10.75,-2.75; 25 -10.75,-3.25; 26 -10.75,-3.75; 27 -10.75,-4.25; 28 -10.75,-4.75; 29 -10.75,-5.25; 30 -10.75,-5.75; 31 -10.75,-6.25; 32 -10.75,-6.75; 33 -10.75,-7.25; 34 -10.75,-7.75; 35 -10.75,-8.25; 36 -10.75,-8.75; 73 10.75,-8.75; 74 10.75,-8.25; 75 10.75,-7.75; 76 10.75,-7.25; 77 10.75,-6.75; 78 10.75,-6.25; 79 10.75,-5.75; 80 10.75,-5.25; 81 10.75,-4.75; 82 10.75,-4.25; 83 10.75,-3.75; 84 10.75,-3.25; 85 10.75,-2.75; 86 10.75,-2.25; 87 10.75,-1.75; 88 10.75,-1.25; 89 10.75,-0.75; 90 10.75,-0.25; 91 10.75,0.25; 92 10.75,0.75; 93 10.75,1.25; 94 10.75,1.75; 95 10.75,2.25; 96 10.75,2.75; 97 10.75,3.25; 98 10.75,3.75; 99 10.75,4.25; 100 10.75,4.75; 101 10.75,5.25; 102 10.75,5.75; 103 10.75,6.25; 104 10.75,6.75; 105 10.75,7.25; 106 10.75,7.75; 107 10.75,8.25; 108 10.75,8.75 | smd 0.3 x 1: 37 -8.75,-10.75; 38 -8.25,-10.75; 39 -7.75,-10.75; 40 -7.25,-10.75; 41 -6.75,-10.75; 42 -6.25,-10.75; 43 -5.75,-10.75; 44 -5.25,-10.75; 45 -4.75,-10.75; 46 -4.25,-10.75; 47 -3.75,-10.75; 48 -3.25,-10.75; 49 -2.75,-10.75; 50 -2.25,-10.75; 51 -1.75,-10.75; 52 -1.25,-10.75; 53 -0.75,-10.75; 54 -0.25,-10.75; 55 0.25,-10.75; 56 0.75,-10.75; 57 1.25,-10.75; 58 1.75,-10.75; 59 2.25,-10.75; 60 2.75,-10.75; 61 3.25,-10.75; 62 3.75,-10.75; 63 4.25,-10.75; 64 4.75,-10.75; 65 5.25,-10.75; 66 5.75,-10.75; 67 6.25,-10.75; 68 6.75,-10.75; 69 7.25,-10.75; 70 7.75,-10.75; 71 8.25,-10.75; 72 8.75,-10.75; 109 8.75,10.75; 110 8.25,10.75; 111 7.75,10.75; 112 7.25,10.75; 113 6.75,10.75; 114 6.25,10.75; 115 5.75,10.75; 116 5.25,10.75; 117 4.75,10.75; 118 4.25,10.75; 119 3.75,10.75; 120 3.25,10.75; 121 2.75,10.75; 122 2.25,10.75; 123 1.75,10.75; 124 1.25,10.75; 125 0.75,10.75; 126 0.25,10.75; 127 -0.25,10.75; 128 -0.75,10.75; 129 -1.25,10.75; 130 -1.75,10.75; 131 -2.25,10.75; 132 -2.75,10.75; 133 -3.25,10.75; 134 -3.75,10.75; 135 -4.25,10.75; 136 -4.75,10.75; 137 -5.25,10.75; 138 -5.75,10.75; 139 -6.25,10.75; 140 -6.75,10.75; 141 -7.25,10.75; 142 -7.75,10.75; 143 -8.25,10.75; 144 -8.75,10.75
2X03 = drill 1.016 octagon: 1 -2.54,-1.27; 2 -2.54,1.27; 3 0,-1.27; 4 0,1.27; 5 2.54,-1.27; 6 2.54,1.27
INDUCTOR_5X5MM_NR5040_NOTHERMALS = smd 1.8 x 4: P$1 -1.8,0; P$2 1.8,0
MSS7348 = smd 1.6 x 2.2: P$1 -3,0; P$2 3,0
CHIP-LED0805 = smd 1.2 x 1.2: A 0,-1.05; C 0,1.05
CTS406 = smd 1.9 x 1.4: 1 -2.2,-1.2; 2 2.2,-1.2; 3 2.2,1.2; 4 -2.2,1.2
SM77H = smd 1.6 x 1.5: 1 -2.55,-1.9; 2 2.55,-1.9; 3 2.55,1.9; 4 -2.55,1.9
R0805 = smd 1.3 x 1.5: 1 -0.95,0; 2 0.95,0
SOIC127P600X175-8N = smd 1.6 x 0.559: 1 -2.642,1.905; 2 -2.642,0.635; 3 -2.642,-0.635; 4 -2.642,-1.905; 5 2.642,-1.905; 6 2.642,-0.635; 7 2.642,0.635; 8 2.642,1.905
QFP80P900X900X120-32N = smd 1.473 x 0.508: 1 -4.115,2.794; 2 -4.115,2.007; 3 -4.115,1.194; 4 -4.115,0.406; 5 -4.115,-0.406; 6 -4.115,-1.194; 7 -4.115,-2.007; 8 -4.115,-2.794; 17 4.115,-2.794; 18 4.115,-2.007; 19 4.115,-1.194; 20 4.115,-0.406; 21 4.115,0.406; 22 4.115,1.194; 23 4.115,2.007; 24 4.115,2.794 | smd 0.508 x 1.473: 9 -2.794,-4.115; 10 -2.007,-4.115; 11 -1.194,-4.115; 12 -0.406,-4.115; 13 0.406,-4.115; 14 1.194,-4.115; 15 2.007,-4.115; 16 2.794,-4.115; 25 2.794,4.115; 26 2.007,4.115; 27 1.194,4.115; 28 0.406,4.115; 29 -0.406,4.115; 30 -1.194,4.115; 31 -2.007,4.115; 32 -2.794,4.115
SO016 = smd 0.6 x 1.2: 1 -4.445,-2.8; 2 -3.175,-2.8; 3 -1.905,-2.8; 4 -0.635,-2.8; 5 0.635,-2.8; 6 1.905,-2.8; 7 3.175,-2.8; 8 4.445,-2.8; 9 4.445,2.8; 10 3.175,2.8; 11 1.905,2.8; 12 0.635,2.8; 13 -0.635,2.8; 14 -1.905,2.8; 15 -3.175,2.8; 16 -4.445,2.8
SOT95P275X110-5N = smd 1.321 x 0.559: 1 -1.27,0.94; 2 -1.27,0; 3 -1.27,-0.94; 4 1.27,-0.94; 5 1.27,0.94
SOT23-5@1 = smd 0.55 x 1.2: 1 -0.95,-1.3; 2 0,-1.3; 3 0.95,-1.3; 4 0.95,1.3; 5 -0.95,1.3
776280-1 = drill 1.8: 1 10.5,13.5; 2 14.5,13.5; 3 18.5,13.5; 4 12.5,9.5; 5 16.5,9.5; 6 10.5,5.5; 7 14.5,5.5; 8 18.5,5.5 | hole 2.85: 4,9; 25,9
SOIC127P1034X264-18N = smd 1.981 x 0.559: 1 -4.699,5.08; 2 -4.699,3.81; 3 -4.699,2.54; 4 -4.699,1.27; 5 -4.699,0; 6 -4.699,-1.27; 7 -4.699,-2.54; 8 -4.699,-3.81; 9 -4.699,-5.08; 10 4.699,-5.08; 11 4.699,-3.81; 12 4.699,-2.54; 13 4.699,-1.27; 14 4.699,0; 15 4.699,1.27; 16 4.699,2.54; 17 4.699,3.81; 18 4.699,5.08
SOIC127P600X175-8N' = smd 1.981 x 0.559: 1 -2.362,1.905; 2 -2.362,0.635; 3 -2.362,-0.635; 4 -2.362,-1.905; 5 2.362,-1.905; 6 2.362,-0.635; 7 2.362,0.635; 8 2.362,1.905
ZIF40 = smd 0.3 x 1.25: P$1 -9.75,0; P$2 -9.25,0; P$3 -8.75,0; P$4 -8.25,0; P$5 -7.75,0; P$6 -7.25,0; P$7 -6.75,0; P$8 -6.25,0; P$9 -5.75,0; P$10 -5.25,0; P$11 -4.75,0; P$12 -4.25,0; P$13 -3.75,0; P$14 -3.25,0; P$15 -2.75,0; P$16 -2.25,0; P$17 -1.75,0; P$18 -1.25,0; P$19 -0.75,0; P$20 -0.25,0; P$21 0.25,0; P$22 0.75,0; P$23 1.25,0; P$24 1.75,0; P$25 2.25,0; P$26 2.75,0; P$27 3.25,0; P$28 3.75,0; P$29 4.25,0; P$30 4.75,0; P$31 5.25,0; P$32 5.75,0; P$33 6.25,0; P$34 6.75,0; P$35 7.25,0; P$36 7.75,0; P$37 8.25,0; P$38 8.75,0; P$39 9.25,0; P$40 9.75,0 | smd 2 x 3: P$41 -11.1,2.3; P$42 11.1,2.35
SOT95P300X145-3N = smd 0.559 x 1.321: 1 -0.94,-1.194; 2 0.94,-1.194; 3 0,1.194

### Placement (x,y rotation side)
AS1  16.51,59.69 0 top
C1  45.72,37.77 0 bottom
C2  45.72,43.51 180 bottom
C3  71.75,17.14 0 bottom
C4  71.75,13.34 180 bottom
C5  63.5,71.12 90 bottom
C6  69.22,45.09 180 bottom
C7  69.22,41.27 0 bottom
C8  82.55,43.18 180 bottom
C9  82.55,46.35 180 bottom
C10  60.96,71.12 90 bottom
C11  54.61,71.12 90 bottom
C12  57.15,71.12 90 bottom
C13  44.45,64.77 0 top
C14  44.45,69.85 0 top
C15  49.53,69.85 180 top
C16  44.45,67.31 0 top
C24  67.31,71.12 90 top
D1  73.66,44.45 270 bottom
D2  40.64,68.58 90 top
D3  46.99,73.66 0 top
FUSE3  87.63,69.85 0 top
IC2  40.64,34.29 0 top
JP1  85.09,21.59 90 top
JTAG1  16.51,72.39 0 top
L1  35.56,71.12 0 top
L5  73.66,69.85 180 top
LED1  38.1,50.8 180 top
LED2  33.02,50.8 180 top
LED3  29.21,50.8 180 top
Q1  64.77,43.18 270 bottom
Q3  67.31,15.24 90 bottom
QG2  35.56,38.1 270 bottom
R1  87.63,44.45 270 bottom
R2  49.53,64.77 0 top
R3  38.1,64.77 90 top
R4  40.64,50.8 90 top
R5  35.56,50.8 90 top
R6  29.21,55.88 90 top
R7  80.01,26.67 0 bottom
R8  78.74,43.18 0 bottom
R9  78.74,46.35 0 bottom
R10  80.01,49.53 0 bottom
R11  49.53,67.31 0 top
R27  7.62,72.39 270 top
R28  25.4,71.12 180 top
R29  55.24,31.11 0 top
R30  16.51,64.77 90 top
R31  16.51,54.61 270 top
R32  13.97,54.61 270 top
R33  25.4,68.58 0 top
U2  35.56,29.21 180 bottom
U3  74.93,20.32 0 top
U4  72.39,31.75 180 top
U5  63.5,21.59 270 top
U6  55.88,69.85 90 top
U7  62.23,69.85 90 top
U8  34.29,64.77 270 top
U$1  107.95,26.67 90 top
U$2  73.66,48.26 0 top
U$3  MCP2551  [SOIC127P600X175-8N']  73.66,50.8 180 bottom
U$4  26.67,10.16 0 top
U$5  45.72,40.64 270 bottom

### Tracks (layer width: path | path; a pad name or v marks a point on that pad's centre or on a via)
50_MHZ  (via drill 0.35)
  Top 0.305: IC2.17 31.23,35.04 v31.75,35.56
  Bottom 0.305: v31.75,35.56 QG2.3
2515_OSC1  (via drill 0.35)
  Top 0.406: v66.93,43.41 67.97,44.45 U$2.8
  Bottom 0.406: C7.2 67.83,41.27 66.82,42.29 | Q1.3 64.88,42.29 66.82,42.29 | 66.82,42.29 66.82,43.32 66.9,43.41 v66.93,43.41
2515_OSC2  (via drill 0.35)
  Top 0.406: v66.67,47.17 66.67,46.94 67.89,45.72 U$2.7
  Bottom 0.406: C6.1 66.27,45.09 Q1.1 65.97,46.46 v66.67,47.17
+3V3  (via drill 0.35)
  Top 0.254: IC2.116 45.82,45.11 45.82,46.71 45.52,47.01 | 45.52,47.01 42.45,47.01 41.31,45.87 40.62,45.87 40.39,45.65 IC2.127 | v49.94,36.52 51.38,36.52 IC2.95 | IC2.102 v50.05,40.04 v50.04,40.03 | 45.52,47.01 45.52,47.02 v47.4,47.02 | IC2.66 46.46,23.61 46.46,24.33 48.26,26.13 v48.26,27.94 | v48.26,27.94 48.26,28.37 | IC2.77 49.35,27.53 48.95,27.94 v48.26,27.94
  Top 0.305: IC2.54 40.39,25.27 v40.36,25.3 | v36.4,25.32 IC2.46 | 29.93,32 IC2.23 | 29.93,32 30.52,32 30.7,31.82 30.7,29.26 30.47,29.04 | IC2.29 | 30.47,29.04 31.29,29.04 v31.39,28.93 | U$4.P$4 18.42,21.24 29.18,32 29.93,32 | v31.67,41.02 31.65,41.04 30.48,41.04 | 30.48,41.04 IC2.5 | IC2.138 34.89,46.03 v34.92,46.07 | IC2.5 30.48,41.04 | IC2.29 | IC2.29 30.47,29.04
  Top 0.61: R5.2 34.92,52.38 v34.92,53.34 | R28.1 R33.2 25.56,67.79 25.56,67.64 25.29,67.37 | JTAG1.4 15.29,72.34 15.29,70.61 v18.53,67.37 25.29,67.37 | R32.2 13.97,51.26 v12.06,49.35 | v10.8,52.76 10.8,57.33 10.21,57.91 10.21,58.92 10.93,59.64 12.65,59.64 AS1.4 | v57.51,68.91 57.15,68.91 U6.3 v56.82,67.13 | v56.21,32.61 56.2,32.6 R29.2 | R4.2 v40.64,53.34 v34.92,53.34 | 25.29,67.37 25.29,60.75 R6.2 31.43,56.83 v34.92,53.34 | U5.1 61.59,26.04 v62.23,25.4 | v48.26,27.94 48.26,28.37 48.26,37.21 v48.55,37.5 | v61.63,37.69 74.37,37.69 76.83,35.23 U4.1
  Bottom 0.254: v50.04,40.03 49.68,40.03 49.24,39.59 | v47.4,47.02 48.55,47.02
  Bottom 0.305: U2.8 38.35,27.3 v40.36,25.3 36.42,25.3 v36.4,25.32 33.17,25.32 31.39,27.1 v31.39,28.93 31.39,29.16 32.08,29.84 U2.3 | QG2.4 33.29,41.02 v31.67,41.02
  Bottom 0.406: U2.8 U2.7 39.47,28.57 47.42,36.52 47.57,36.52 | 47.57,36.52 v49.94,36.52 | 48.08,37.03 47.57,36.52
  Bottom 0.508: v48.55,37.5 48.08,37.03
  Bottom 0.61: AS1.4 13.97,61.61 12.75,62.83 12.75,71.62 13.97,72.84 JTAG1.4 | QG2.4 33.16,41.15 32.8,41.15 31.73,42.22 31.73,42.87 v34.92,46.07 v34.92,53.34 | R31.2 16.51,56.7 17.73,57.91 17.73,66.57 v18.53,67.37 | v12.06,49.35 10.8,50.62 v10.8,52.76 | v57.51,68.91 57.51,69.76 C12.1 | v56.82,67.13 48.55,58.86 48.55,54.61 | 48.55,54.61 48.55,47.02 48.55,40.27 | 48.55,40.27 49.24,39.59 v56.21,32.61 61.29,37.69 v61.63,37.69 | 48.55,40.27 v48.55,37.5 | 48.55,54.61 41.91,54.61 v40.64,53.34 | v62.23,25.4 62.23,24.13 60.96,22.86 52.07,22.86 48.26,26.67 v48.26,27.94
  other vias: 16.51,53.66
+5V  (via drill 0.35)
  Top 0.406: JP1.2 83.08,18.31 U3.18 78.84,18.52 78.16,18.52 77.58,19.1 v74.93,19.1 70.79,19.1 | 70.79,19.1 70.13,19.1 70.13,19.11 69.72,19.51 69.72,20.32 69.93,20.52 70.61,20.52 U3.4 | U3.6 70.79,19.1
  Top 0.61: U$2.18 75.26,56.44 v69.36,56.44 63.17,62.62 63.17,67.51 | 63.17,67.51 U7.3 63.52,68.94 v63.91,68.94 | L1.P$1 33.76,67.55 U8.5 38.03,65.72 R3.2 39.05,65.79 40.31,64.52 40.97,64.52 41.22,64.77 C13.1 43.57,64.77 44.68,63.66 59.32,63.66 63.17,67.51
  Bottom 0.406: R7.2 74.93,22.54 v74.93,19.1
  Bottom 0.61: 65.71,51.68 66.23,51.16 66.97,51.16 67.24,51.44 U$3.3 | 65.71,51.68 65.71,52.41 69.36,56.05 v69.36,56.44 | JP1.2 85.14,20.37 86.86,20.37 87.58,21.09 87.58,24.64 84.34,27.88 80.12,27.88 78.43,26.18 73.52,26.18 69.17,30.53 66.52,30.53 66.52,32.1 62.41,36.21 62.41,46.52 65.71,49.82 65.71,51.68 | C5.1 63.8,69.81 63.8,69.04 v63.91,68.94
+12V  (via drill 0.35)
  Top 0.61: C24.1 62.63,69.72 | 62.63,69.72 v62.23,69.32 U7.2 | 62.63,69.72 56.28,69.72 v55.88,69.32 U6.2 | v47.77,49.53 49.33,51.1 v49.33,51.13 | v70.69,68.12 70.69,69.82 L5.P$2
  Top 0.813: C24.1 67.44,69.85 L5.P$2
  Bottom 0.61: C10.1 61.76,69.32 v62.23,69.32 | C11.1 55.41,69.32 v55.88,69.32 | U$5.3 44.53,43.32 C2.1 45.61,44.4 45.61,46.34 47.77,48.49 v47.77,49.53 | v49.33,51.13 53.83,55.62 53.83,56.2 65.74,68.12 v70.69,68.12
ASDO  (via drill 0.35)
  Top 0.305: v33.78,42.57 33.38,42.57 32.77,43.18 32.25,43.18 32.11,43.04 30.25,43.04 | 30.25,43.04 IC2.1 | AS1.9 21.59,50.91 29.46,43.04 30.25,43.04
  Bottom 0.305: v33.78,42.57 34.37,42.57 35.63,41.31 35.63,33.46 35.64,33.45 35.64,32.38 36.91,31.11 U2.5
BLUE_0
  Top 0.305: IC2.52 39.39,22.04 31.65,14.3 29.33,14.3 26.96,11.94 26.96,10.2 U$4.P$21
BLUE_1
  Top 0.305: IC2.53 39.89,21.89 31.84,13.84 29.52,13.84 27.46,11.79 27.46,10.2 U$4.P$22
BLUE_2
  Top 0.305: IC2.55 40.89,22.25 32.03,13.39 29.71,13.39 27.96,11.64 27.96,10.2 U$4.P$23
BLUE_3
  Top 0.305: IC2.57 41.89,22.57 32.25,12.93 29.9,12.93 28.46,11.49 28.46,10.2 U$4.P$24
BLUE_4
  Top 0.305: IC2.58 42.39,22.42 32.44,12.47 30.09,12.47 28.96,11.35 28.96,10.2 U$4.P$25
BLUE_5
  Top 0.305: IC2.59 42.89,22.28 32.63,12.01 30.27,12.01 29.51,11.24 29.44,11.18 29.44,10.18 U$4.P$26
BLUE_6
  Top 0.305: IC2.60 43.39,22.13 32.82,11.56 30.46,11.56 29.96,11.05 29.96,11.04 29.92,11 U$4.P$27
BLUE_7
  Top 0.254: U$4.P$28 30.42,10.84 30.71,11.12 33.02,11.12 44.82,22.92 44.82,22.93 44.89,23 IC2.63
CANH
  Bottom 0.152: R1.1 87.63,45.17
  Bottom 0.406: U$3.7 74.83,50.16 74.5,49.84 74.5,45.66 D1.1 76.83,45.4 R9.2 78.68,45.46 78.97,45.17 87.63,45.17 U$1.3
CANL
  Bottom 0.152: R1.2 87.63,43.17
  Bottom 0.406: U$3.6 74.95,51.44 73.7,50.18 73.7,44.75 74.76,43.7 D1.2 75.08,43.18 R8.2 78.68,42.29 78.68,42.28 78.94,42.02 84.35,42.02 85.49,43.17 87.63,43.17 U$1.5
CONF_DONE  (via drill 0.35)
  Top 0.305: AS1.3 R32.1 12.91,54.51 12.91,52.88 13.19,52.61 v13.19,51.59 | IC2.83 v49.49,30.54 v49.48,30.53 | v42.55,30.53 34.41,38.66 34.41,42.83 33.61,43.63 29.75,43.63 v28.63,44.76 | v17.98,46.3 19.48,46.3 20.06,46.89 24.07,46.89 v26.19,44.76
  Bottom 0.305: v49.48,30.53 v42.55,30.53 | v28.63,44.76 v26.2,44.76 v26.19,44.76 | v13.19,51.59 17.98,46.79 v17.98,46.3
DATA0  (via drill 0.35)
  Top 0.305: v33.86,37.34 33.81,37.29 31.85,37.29 31.11,36.55 29.93,36.55 29.91,36.52 IC2.14 19.58,36.54 18.16,37.96 18.16,41.72 17.35,42.52 17.35,51.82 19.05,53.52 AS1.7
  Bottom 0.305: U2.2 33.6,29.26 33.84,29.26 34.72,30.13 34.72,36.48 v33.86,37.33 v33.86,37.34
DCLK  (via drill 0.35)
  Top 0.305: v36.8,29.82 36.8,32.72 33.49,36.03 | 33.49,36.03 33.48,36.04 | 33.49,36.03 32.17,36.03 32.01,36.19 31.49,36.19 31.34,36.04 IC2.15 19.43,36.04 17.37,38.1 17.37,41.3 v17.52,41.45 | v15.8,43.03 11.43,47.4 AS1.1
  Bottom 0.305: U2.6 36.83,29.84 v36.8,29.82 | v17.52,41.45 17.38,41.45 v15.8,43.03
DISP_CLK  (via drill 0.35)
  Top 0.254: U$4.P$30 31.42,9.42 31.31,9.3 31.31,9.02 31.05,8.76 30.86,8.76 v30.86,8.12
  Top 0.305: 31.38,10.12 U$4.P$30 | v24.74,39.13 24.96,39.35 24.96,40.9 26.33,42.27 28.83,42.27 29.06,42.04 IC2.3 | v30.86,8.12
  Bottom 0.305: v30.86,8.12 30.86,8.36 30.58,8.64 30.58,19.74 26.34,23.98 26.34,37.49 24.96,38.87 24.96,38.9 v24.74,39.13
DISP_DEN  (via drill 0.35)
  Top 0.305: IC2.9 28.26,39.04 v28.17,39.13 | v34.09,9.05 33.91,9.23 33.64,9.23 33.42,9.45 U$4.P$34
  Bottom 0.305: v28.17,39.13 28.17,24.74 32.41,20.5 32.41,10.73 v34.09,9.05
DISP_EN  (via drill 0.35)
  Top 0.305: IC2.4 28.91,41.54 28.64,41.81 26.52,41.81 25.42,40.71 25.42,39.66 v25.59,39.48 | v31.79,8.09 31.79,8.41 31.74,8.45 31.74,9.13 31.88,9.27 31.88,10.12 U$4.P$31
  Bottom 0.305: v25.59,39.48 25.59,38.92 26.8,37.72 26.8,24.17 31.04,19.93 31.04,8.83 v31.79,8.09
DISP_HSYNC  (via drill 0.35)
  Top 0.305: U$4.P$32 32.42,8.76 v32.37,8.71 | v26.45,39.13 26.68,39.35 26.68,39.39 27.51,40.22 28.62,40.22 28.8,40.04 IC2.7
  Bottom 0.305: v32.37,8.71 32.37,9.48 31.5,10.35 31.5,20.12 27.25,24.36 27.25,38.29 26.68,38.87 26.68,38.9 v26.45,39.13
DISP_LEDA  (via drill 0.35)
  Top 0.305: U$4.P$2 17.42,12.09 v17.55,12.22 | v40.64,65.3 D2.C
  Top 0.61: D2.C 42.85,66.73 C16.1 C14.1 44.64,71.06 D3.C
  Bottom 0.305: v17.55,12.22 17.55,12.54 17.68,12.67 17.68,35.46 24.13,41.91 24.13,48.79 v40.64,65.3
DISP_LEDK  (via drill 0.35)
  Top 0.305: v17.05,12.93 16.92,12.8 U$4.P$1 | v51.64,67.28 50.57,67.28 R11.2
  Top 0.61: U8.3 31.18,63.82 30.89,64.11 30.89,74.02 32.66,75.79 48.44,75.79 49.34,74.89 D3.A 49.34,71.06 C15.1 R11.2 | R11.2 50.57,67.28 | R2.2 R11.2
  Bottom 0.305: v17.05,12.93 17.05,14.83 17.09,14.87 17.09,35.52 23.37,41.8 23.37,43.2 23.67,43.51 23.67,49.23 41.73,67.28 v51.64,67.28
DISP_PWM  (via drill 0.35)
  Top 0.305: v75.34,17.45 U3.13 | U8.4 35.66,63.75 R3.1 38.1,58.04 53.42,42.73 53.42,41.83 60.78,34.47 v63.04,34.47
  Bottom 0.305: v75.34,17.45 75.34,17.8 65.91,27.22 65.91,31.62 65.89,31.62 v63.04,34.47
DISP_VSYNC  (via drill 0.35)
  Top 0.305: U$4.P$33 32.92,9.06 v33.23,8.75 | v27.31,39.13 27.54,39.35 27.54,39.39 27.91,39.76 28.43,39.76 28.65,39.54 IC2.8
  Bottom 0.305: v33.23,8.75 33.23,9.27 31.95,10.54 31.95,20.31 27.71,24.55 27.71,38.69 27.54,38.87 27.54,38.9 v27.31,39.13
FPGA_D0_3_3  (via drill 0.35)
  Top 0.305: IC2.75 55.05,26.54 55.66,27.15 58.16,27.15 v65.37,34.37 | v67.11,36.12 67.71,36.72 68.23,36.72 68.58,36.37 74.6,36.37 75.56,35.41 U4.2
  Bottom 0.305: v65.37,34.37 67.11,36.11 v67.11,36.12
FPGA_D1_3_3  (via drill 0.35)
  Top 0.305: v67.97,36.09 68.14,35.91 71.72,35.91 72.36,35.28 72.36,35.22 U4.4 | v66.78,34.82 66.6,35 65.11,35 58.19,28.08 54.35,28.08 53.31,27.05 51.4,27.05 IC2.76
  Bottom 0.305: v67.97,36.09 66.78,34.89 v66.78,34.82
FPGA_D2_3_3
  Top 0.305: U4.6 69.82,35.22 69.82,35.28 69.64,35.45 64.92,35.45 58,28.54 IC2.79
FPGA_D3_3_3  (via drill 0.35)
  Top 0.305: U4.10 69.22,28.02 68.81,27.61 64.51,27.61 v64.33,27.79 | v54.13,29.17 54.09,29.17 53.91,29 51.43,29 IC2.80
  Bottom 0.305: v64.33,27.79 64.01,27.79 63.84,27.96 63.31,27.96 63.14,27.79 55.52,27.79 v54.13,29.17
FPGA_DATA0
  Top 0.305: U3.23 79.27,22.55 79.91,22.55 80.09,22.73 80.09,30.59 77.56,33.12 75.06,33.12 74.3,33.88 U4.3
FPGA_DATA1
  Top 0.305: U3.24 79.05,30.99 77.37,32.66 72.34,32.66 71.78,33.22 71.78,34.52 U4.5
FPGA_DATA2
  Top 0.305: U3.25 77.72,25.21 78.49,25.97 78.49,30.9 77.18,32.21 70.92,32.21 69.22,33.91 U4.7
FPGA_DATA3
  Top 0.305: U3.26 77.17,24.66 77.17,25.3 78.03,26.16 78.03,30.71 76.99,31.75 69.44,31.75 67.94,30.25 U4.9
FPGA_R0_3_3  (via drill 0.35)
  Top 0.305: IC2.81 53.28,29.54 v53.37,29.63 | v59.36,24.77 U5.2
  Bottom 0.305: v59.36,24.77 58.69,25.43 55.85,25.43 53.49,27.79 53.49,29.5 v53.37,29.63
FPGA_R1_3_3  (via drill 0.35)
  Top 0.305: U5.4 60.03,22.89 59.97,22.89 57.96,24.91 v55.48,24.91 | v52.8,31.63 52.39,32.04 IC2.86
  Bottom 0.305: v52.8,31.63 52.8,29.96 52.74,29.89 52.74,27.65 v55.48,24.91
FPGA_R2_3_3  (via drill 0.35)
  Top 0.305: v54.59,24.91 55.22,24.28 55.75,24.28 55.92,24.45 57.76,24.45 59.28,22.93 59.28,20.09 59.69,19.68 U5.6 | v52.82,32.5 51.43,32.5 IC2.87
  Bottom 0.305: v54.59,24.91 54.59,25.16 52.28,27.46 52.28,31.25 52.17,31.36 52.17,31.89 52.54,32.26 52.58,32.26 v52.82,32.5
FPGA_R3_3_3  (via drill 0.35)
  Top 0.305: v57.5,23.82 58.83,22.49 58.83,19.9 59.65,19.08 62.64,19.08 63.3,18.41 U5.10 | v52.73,33.36 52.73,34.49 52.18,35.04 IC2.92
  Bottom 0.305: v52.73,33.36 52.73,33.3 51.72,32.29 51.72,26.89 54.33,24.28 57.04,24.28 v57.5,23.82
FPGA_REG0
  Top 0.305: U3.2 70.59,22.55 69.95,22.55 67.11,25.4 63.52,25.4 61.62,23.5 U5.3
FPGA_REG1
  Top 0.305: U3.9 72.14,12.47 70.74,11.07 67.77,11.07 67.16,11.68 67.16,16.02 67.66,16.53 67.66,20.92 67.03,21.56 66.38,21.56 66.37,21.57 62.23,21.57 61.62,20.95 U5.5
FPGA_REG2
  Top 0.305: U3.10 72.92,12.61 70.93,10.62 67.58,10.62 66.7,11.49 66.7,16.21 67.2,16.72 67.2,17.57 67.03,17.75 61.37,17.75 U5.7
FPGA_REG3
  Top 0.305: U3.11 73.74,12.78 71.12,10.16 67.39,10.16 66.24,11.3 66.24,17.09 U5.9
FPGA_REG_SEL
  Top 0.305: U4.11 70.48,30.63 71.14,31.29 76.8,31.29 77.57,30.52 77.57,26.59 76.12,25.15 U3.27
FPGA_RSEL_3_3  (via drill 0.35)
  Top 0.305: U4.12 71.75,27.64 70.33,26.21 68.26,26.21 67.32,27.15 63.75,27.15 v63.58,27.33 | IC2.73 55.59,25.54 v56.12,26.06
  Bottom 0.305: v56.12,26.06 57.38,27.33 v63.58,27.33
FPGA_W_3_3
  Top 0.305: U4.15 74.9,29.61 74.9,29.68 74.72,29.86 72.6,29.86 72.42,29.68 72.42,27.66 70.52,25.76 68.07,25.76 67.13,26.7 55.85,26.7 55.19,26.04 IC2.74
FPGA_WRITE
  Top 0.305: U4.14 73.63,28.29 73.63,28.22 70.81,25.41 U3.1
GND  (via drill 0.35)
  Top 0.152: IC2.38 IC2.39
  Top 0.203: 29.26,40.59 29.84,40.59 IC2.6
  Top 0.254: U$4.P$29 30.85,10.09 30.85,9.42 30.37,8.94 v29.59,8.94 | U$4.P$3 17.93,10.15 17.93,8.87 | 52.5,38.02 51.41,38.02 IC2.98 50.66,38.04 50.65,38.05 | IC2.85 v49.74,31.54 v49.73,31.55 | IC2.78 50.29,28.04 49.51,28.83 v49.48,28.83 | IC2.105 50.63,41.54 50.62,41.53 | 42.39,46.25 42.54,46.25 v42.7,46.41 44.7,46.41 45.39,45.72 | IC2.117 45.39,45.72 | 45.39,45.72 45.39,45.77 45.19,45.97
  Top 0.305: v27,40.97 28.88,40.97 29.26,40.59 | 29.09,26.32 29.09,25.76 29.31,25.54 IC2.36 | 29.09,26.32 29.27,26.5 29.85,26.5 IC2.34 30.35,26.54 30.58,26.77 30.58,26.95 30.49,27.04 IC2.33 | IC2.36 29.89,24.46 31.61,22.73 32.17,22.73 32.34,22.91 32.34,23 IC2.39 | 29.09,26.32 28.98,26.32 v26.05,23.38 | IC2.49 37.93,23.5 37.93,22.92 38.26,22.59 v38.26,22.5 | IC2.33 | 41.91,24.34 41.61,24.34 41.43,24.16 41.43,23.58 IC2.56 | 41.91,24.34 43.67,24.34 43.85,24.16 43.85,23.58 | IC2.61 43.85,23.58 | 41.91,24.34 v41.91,24.52 | v47.4,24.41 v47.39,24.4 IC2.68 47.39,22.64 47.4,22.63 | U$4.P$36 34.42,11.6 v34.58,11.75 | IC2.123 42.39,46.25 42.47,46.33 | 40.41,46.35 39.89,45.83 IC2.128 39.93,45.08 39.93,45.81 40.49,46.37 40.49,47.57 | IC2.130 38.89,47.93 v38.33,48.49 | IC2.140 33.89,46.54 33.91,46.56 | IC2.111 48.39,46.23 48.49,46.33 48.89,45.93 IC2.110 | IC2.105 52.92,41.54 52.93,41.53 | IC2.108 52.07,43.04 | 52.07,43.04 52.34,43.04 52.38,43 | IC2.61 43.85,23.58 | IC2.19 v31.59,34.04 v31.6,34.04 | IC2.33 | IC2.36 | IC2.106 52.2,42.04 52.25,42.09 52.2,42.14 52.2,42.82 52.07,42.94 52.07,43.04
  Top 0.406: 73.53,19.91 U3.5 | 73.53,19.91 77.22,19.91 78.03,20.73 U3.21 | U3.3 70.84,21.49 71.96,21.49 73.53,19.91
  Top 0.61: v68.38,23.24 69.62,21.99 69.62,21.88 69.99,21.51 U3.3 | v46.99,69.85 v46.99,71.12
  Bottom 0.406: C8.2 84.71,43.18 85.26,43.73 85.4,43.73 v85.52,43.85
  Bottom 0.61: C2.2 46.91,43.32 U$5.1
  other vias: 26.67,63.5 39.37,55.88 54.61,55.88 39.37,40.64 45.72,27.94 54.61,54.61 53.34,44.45 68.58,67.31 82.55,53.34 82.91,25.65 67.94,33.17 53.34,39.37 46.79,46.18 40.64,74.3 40.64,73
  pour Bottom (isolate 0.254): 0,83.82 107.95,83.82 107.95,0 0,0
  pour Top (isolate 0.254): 0,83.82 0,0 107.95,0 107.95,83.82
GREEN_0
  Top 0.305: IC2.41 33.89,21.71 30.14,17.96 27.81,17.96 22.96,13.11 22.96,10.2 U$4.P$13
GREEN_1
  Top 0.305: IC2.42 34.39,21.57 30.32,17.5 28,17.5 23.42,12.92 U$4.P$14
GREEN_2
  Top 0.305: IC2.43 34.89,21.42 30.51,17.04 28.19,17.04 23.92,12.77 U$4.P$15
GREEN_3
  Top 0.305: IC2.44 35.39,21.27 30.7,16.59 28.38,16.59 24.42,12.62 U$4.P$16
GREEN_4
  Top 0.305: IC2.45 35.89,21.13 30.89,16.13 28.57,16.13 24.96,12.52 24.96,10.2 U$4.P$17
GREEN_5
  Top 0.305: IC2.47 36.89,21.48 31.08,15.67 28.76,15.67 25.46,12.38 25.46,10.2 U$4.P$18
GREEN_6
  Top 0.305: IC2.48 37.39,21.33 31.27,15.21 28.95,15.21 25.96,12.23 25.96,10.2 U$4.P$19
GREEN_7
  Top 0.305: IC2.51 38.89,22.19 31.46,14.76 29.14,14.76 26.46,12.08 26.46,10.2 U$4.P$20
LED1
  Top 0.305: LED1.C 39.39,48.46 IC2.129
LED2
  Top 0.305: LED2.C 34.03,48.74 36.91,48.74 37.9,47.75 IC2.132
MISO
  Top 0.406: U3.16 77.72,15.6 78.87,14.45 81.76,14.45 JP1.1 86.36,20.01 87.48,21.13 87.48,22.05 86.82,22.71 83.49,22.71 81.71,24.49 81.71,25.04 81.71,47.75 79.93,49.53 U$2.15
MOSI  (via drill 0.35)
  Top 0.406: U3.15 76.94,18.03 v76.96,18.06 | JP1.4 81.15,24.26 81.15,46.94 79.86,48.23 78.38,48.23 U$2.14
  Bottom 0.406: JP1.4 81.36,21.59 81.13,21.36 80.26,21.36 v76.96,18.06 76.94,18.03
N$1
  Top 0.813: L5.P$1 78.36,71.55 FUSE3.P$1 FUSE3.P$4
N$2
  Top 0.406: R4.1 39.75,50.74 39.74,50.74 38.64,51.85 LED1.A
N$3
  Top 0.406: R5.1 34.67,50.74 34.66,50.74 33.56,51.85 LED2.A
N$4
  Top 0.61: LED3.A R6.1
N$5
  Bottom 0.406: U$3.8 78.42,48.9 R10.2
N$6
  Bottom 0.406: R8.1 C8.1
N$7
  Bottom 0.406: R9.1 C9.1
N$8  (via drill 0.35)
  Top 0.61: D2.A 38.05,70.43 L1.P$2 35.34,69.09 v35.34,67.08 | v34.04,65.71 U8.1
  Bottom 0.61: v35.34,67.08 34.04,65.79 v34.04,65.71
N$14  (via drill 0.35)
  other vias: 38.1,33.02
N$21
  Top 0.305: IC2.82 52.11,30.04 53.19,31.11 R29.1
NCE
  Top 0.305: R30.1 AS1.6 17.58,59.89 17.58,52.9 16.89,52.21 16.89,38.43 16.89,37.93 19.29,35.53 IC2.16
NCONFIG
  Top 0.305: AS1.5 R31.1 15.46,54.51 15.46,52.88 16.43,51.91 16.43,37.74 20.64,33.54 IC2.20
NCSO  (via drill 0.35)
  Top 0.305: v32.51,42.55 IC2.2 29.85,42.58 29.27,42.58 20.12,51.73 20.12,58.86 19.05,59.93 AS1.8
  Bottom 0.305: U2.1 33.6,27.99 33.84,27.99 35.17,29.32 35.17,41.12 34.54,41.76 33.3,41.76 v32.51,42.55
PWR_IN_12
  Top 0.813: FUSE3.P$2 FUSE3.P$3 87.94,63.49 87.94,41.51 89.36,40.09 89.36,40.08 90.27,39.17 U$1.4
RED_0
  Top 0.305: U$4.P$5 18.96,10.2 18.96,21.13 28.83,31 29.85,31 IC2.25
RED_1
  Top 0.305: IC2.26 29.85,30.5 28.97,30.5 19.42,20.94 U$4.P$6
RED_2
  Top 0.305: IC2.27 29.85,30 29.12,30 19.92,20.8 U$4.P$7
RED_3
  Top 0.254: 29.26,29.5 29.31,29.54 IC2.28
  Top 0.305: U$4.P$8 20.46,10.2 20.46,20.69 29.26,29.5
RED_4
  Top 0.305: IC2.30 29.85,28.5 28.97,28.5 20.92,20.44 U$4.P$9
RED_5
  Top 0.305: IC2.31 29.85,28 29.12,28 21.42,20.3 U$4.P$10
RED_6
  Top 0.254: 29.26,27.5 29.31,27.54 IC2.32
  Top 0.305: 29.26,27.5 21.92,20.15 U$4.P$11
RED_7
  Top 0.305: IC2.40 33.39,21.86 29.95,18.41 27.62,18.41 22.42,13.21 U$4.P$12
RESET  (via drill 0.35)
  Top 0.305: U$2.17 79.05,51.38 79.48,51.38 82.22,48.64 82.22,28.27 JP1.5 | v75.61,22.26 74.52,23.35 U3.29
  Bottom 0.305: JP1.5 83.82,26.67 R7.1 80.89,26.67 79.84,25.61 78.97,25.61 v75.61,22.26
RXCAN  (via drill 0.35)
  Top 0.406: v66.6,52.05 66.62,52.07 U$2.2
  Bottom 0.406: U$3.4 67.26,52.7 v66.6,52.05
SCK
  Top 0.406: U3.17 83.92,17.53 83.92,17.57 84.94,18.59 84.94,20.17 JP1.3 85.4,21.59 84.28,20.47 83.36,20.47 82.7,21.13 82.7,21.82 80.59,23.93 80.59,45.9 79.5,46.99 U$2.13
TCK  (via drill 0.35)
  Top 0.305: IC2.12 22.99,37.54 22.05,38.48 22.05,42.74 22.22,42.92 22.22,43.47 v20.96,44.73
  Top 0.406: R27.2 11.11,71.44 JTAG1.1
  Bottom 0.305: JTAG1.1 11.43,62.47 12.5,61.4 12.5,53.19 v20.96,44.73
TDI  (via drill 0.35)
  Top 0.305: R28.2 JTAG1.9 | IC2.13 29.86,37.01 29.74,37.01 29.73,37 22.86,37 21.59,38.27 v21.59,43.18
  Bottom 0.305: v21.59,43.18 21.59,56.91 22.66,57.98 22.66,61.4 21.59,62.47 JTAG1.9
TDO  (via drill 0.35)
  Top 0.305: IC2.10 29.85,38.5 23.32,38.5 23.16,38.66 23.16,44.31 21.22,46.26 v20.33,46.26
  Bottom 0.305: JTAG1.3 13.97,62.47 15.04,61.4 15.04,51.54 v20.33,46.26
TMS  (via drill 0.35)
  Top 0.305: R33.1 19.05,68.58 JTAG1.5 | 29.85,38 IC2.11 23.14,38.04 22.71,38.47 22.71,43.87 v20.96,45.62
  Bottom 0.305: v20.96,45.62 20.96,57.54 20.52,57.98 20.52,67.11 JTAG1.5
TXCAN  (via drill 0.35)
  Top 0.406: v70.79,54.05 70.05,53.31 68.99,53.31 U$2.1
  Bottom 0.406: U$3.1 71.93,49.53 72.44,49.53 72.64,49.74 72.64,53.13 72.44,53.34 72.11,53.34 71.4,54.05 v70.79,54.05
VCC  (via drill 0.35)
  Top 0.254: 38.44,44.41 38.39,44.46 IC2.131 | 30.7,24.73 30.7,25.95 30.6,26.04 IC2.35 | v47.77,39.84 49.39,41.47 49.42,41.47
  Top 0.305: 30.7,24.73 IC2.37 31.93,23.59 31.93,24.17 34.44,26.67 38.35,26.67 | 38.35,26.67 43.18,26.67 | IC2.50 38.39,26.63 38.35,26.67 | 43.18,26.67 43.18,35.23 49.42,41.47 | 49.42,41.47 50.49,42.55 50.5,42.54 IC2.107 | IC2.109 49.39,41.49 49.42,41.47 | 38.44,44.41 41.38,41.47 41.91,41.47 | 41.91,41.47 49.42,41.47 | IC2.124 41.89,41.49 41.91,41.47 | 43.18,26.67 44.39,25.46 IC2.62 | IC2.62 | IC2.62
  Bottom 0.254: 47.79,39.84 47.65,39.7 U$5.2 47.62,39.7 v47.77,39.84
  Bottom 0.61: C1.1 46.91,37.96 U$5.2
XTAL1  (via drill 0.35)
  Top 0.406: U3.7 69.55,18.31 v68.56,19.3
  Bottom 0.406: C3.2 68.81,17.14 Q3.3 68.56,17.48 v68.56,19.3
XTAL2  (via drill 0.35)
  Top 0.406: v69.37,15.21 69.37,16.08 U3.8
  Bottom 0.406: C4.1 70.37,13.34 69.36,14.35 | 69.36,14.35 67.42,14.35 Q3.1 | 69.36,14.35 69.36,15.18 69.37,15.19 v69.37,15.21
~CS_CAN  (via drill 0.35)
  Top 0.305: U3.28 75.08,24.69 75.08,25.3 74.19,26.19 v74.19,27.87 | U$2.16 75.31,50.8 74.07,49.55 v74.07,39.06
  Bottom 0.305: v74.19,27.87 74.02,28.04 74.02,35.53 74.07,35.59 v74.07,39.06
~INT_CAN  (via drill 0.35)
  Top 0.305: U3.32 72.14,25.84 v73.56,27.26 | v74.7,39.7 74.7,43.51 76.91,45.72 U$2.12
  Bottom 0.305: v73.56,27.26 73.56,35.53 | 73.56,35.53 | v74.7,39.7 73.81,39.7 73.43,39.33 73.43,38.8 73.56,38.68 73.56,35.53
(copper drawn outside any net)
  shapes: Top area x4

### Text on the board
tSilk: DISPLAY / IFE 2018 | Schematic: Andrew Smith / PCB: Andrew Smith / Software: Andrew Smith